# EAGLE schematic BMS (EAGLE 9.6.2)
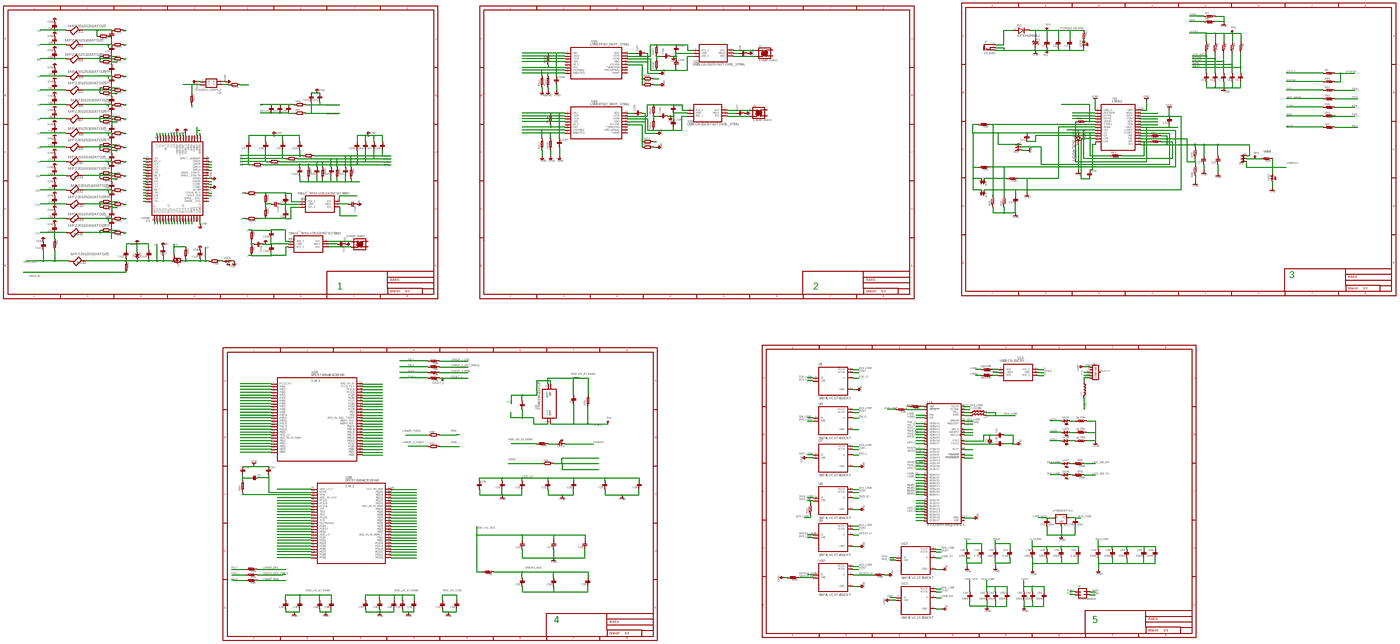
[diagram p0: schematic, sheet 1, overview]
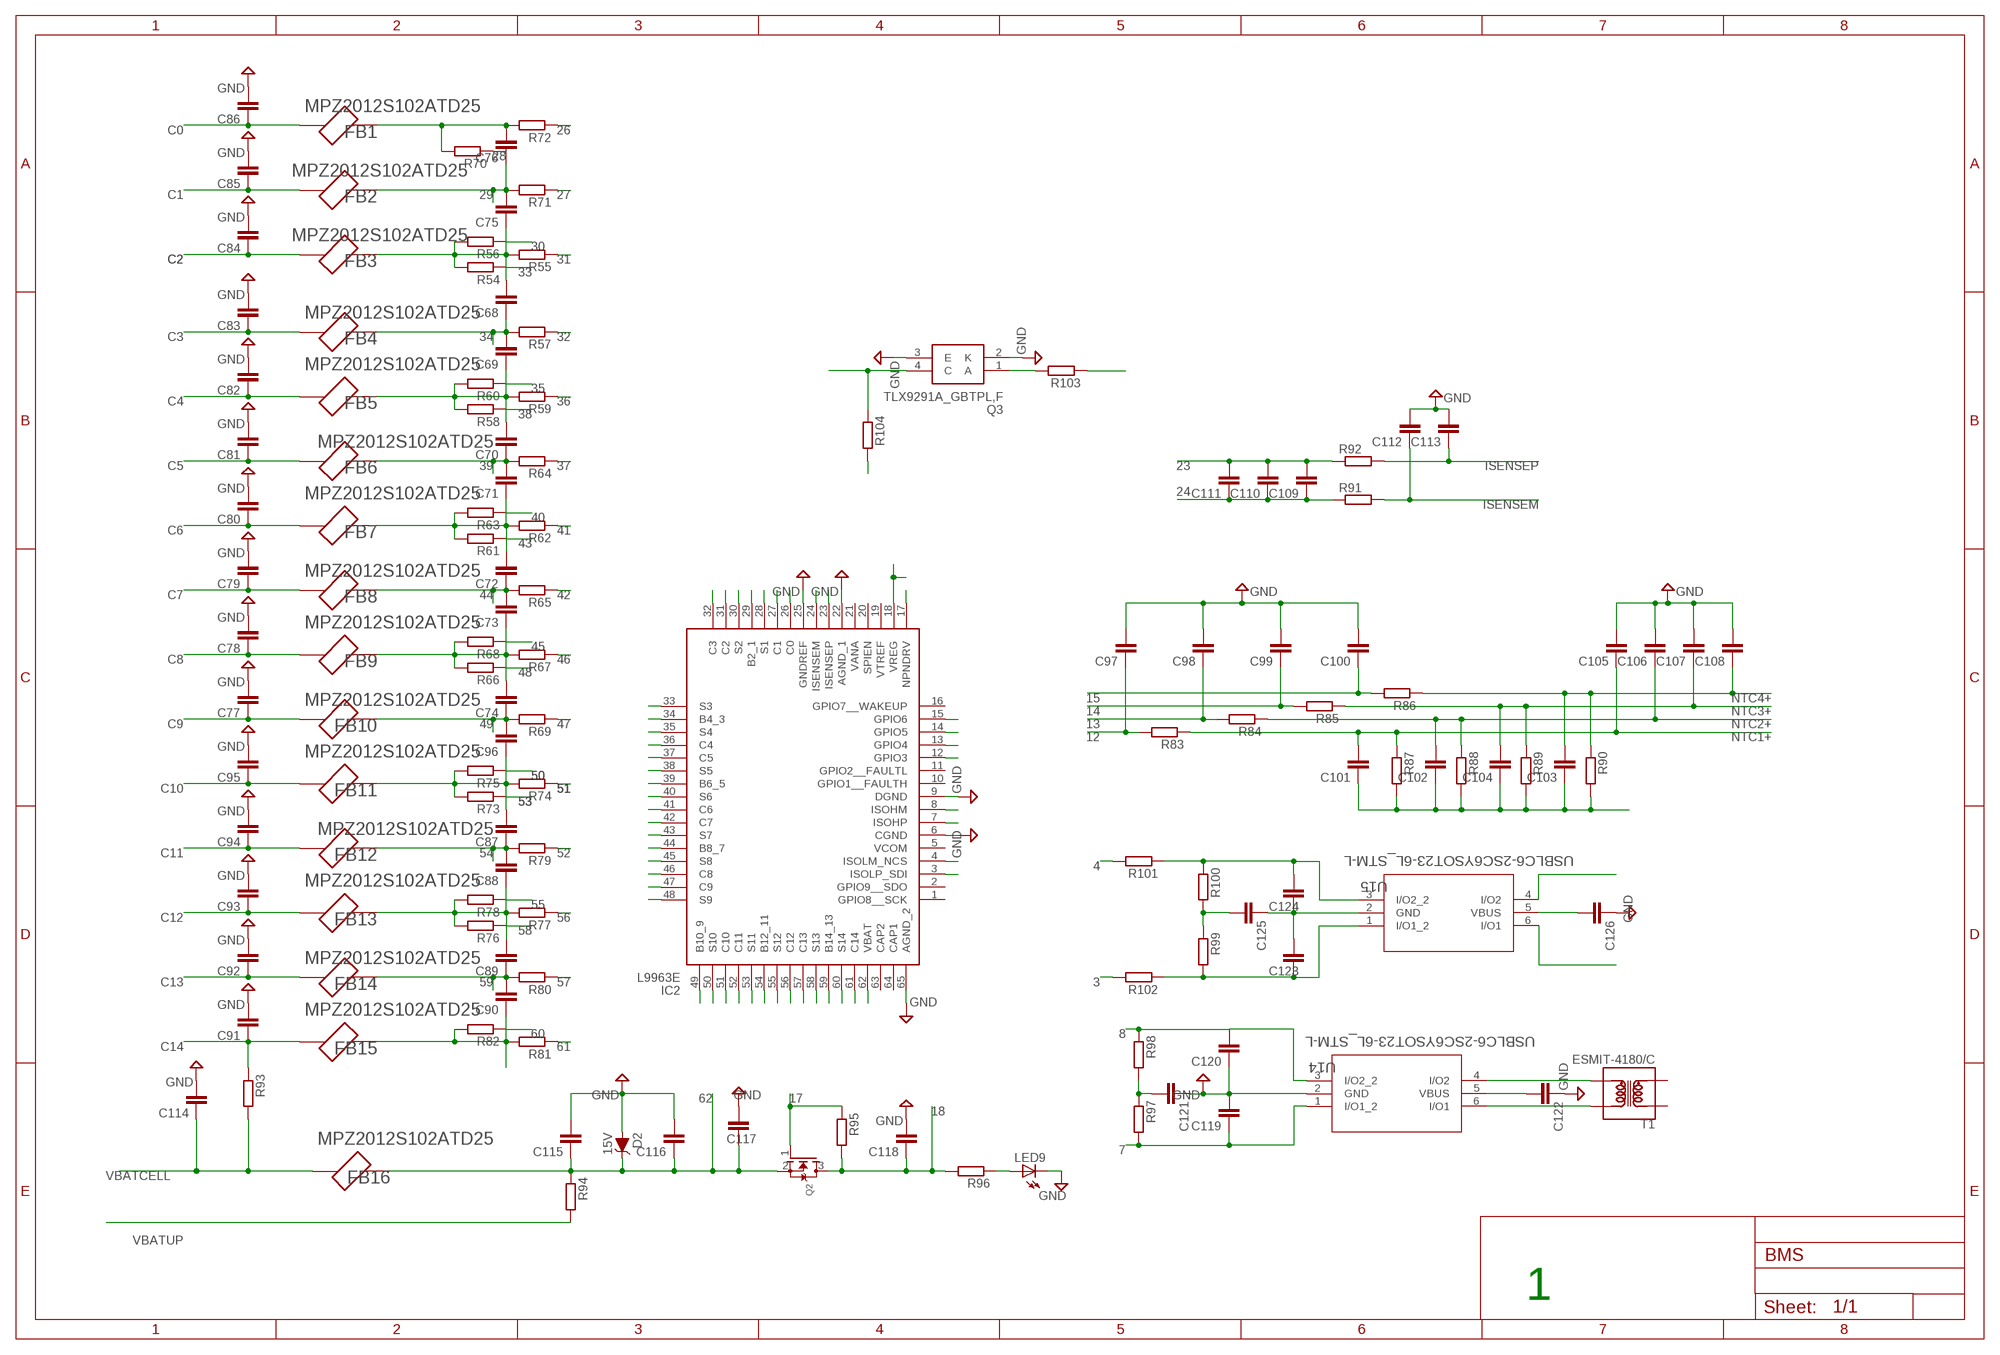
[diagram p1: schematic, sheet 1, part 1 of 7]
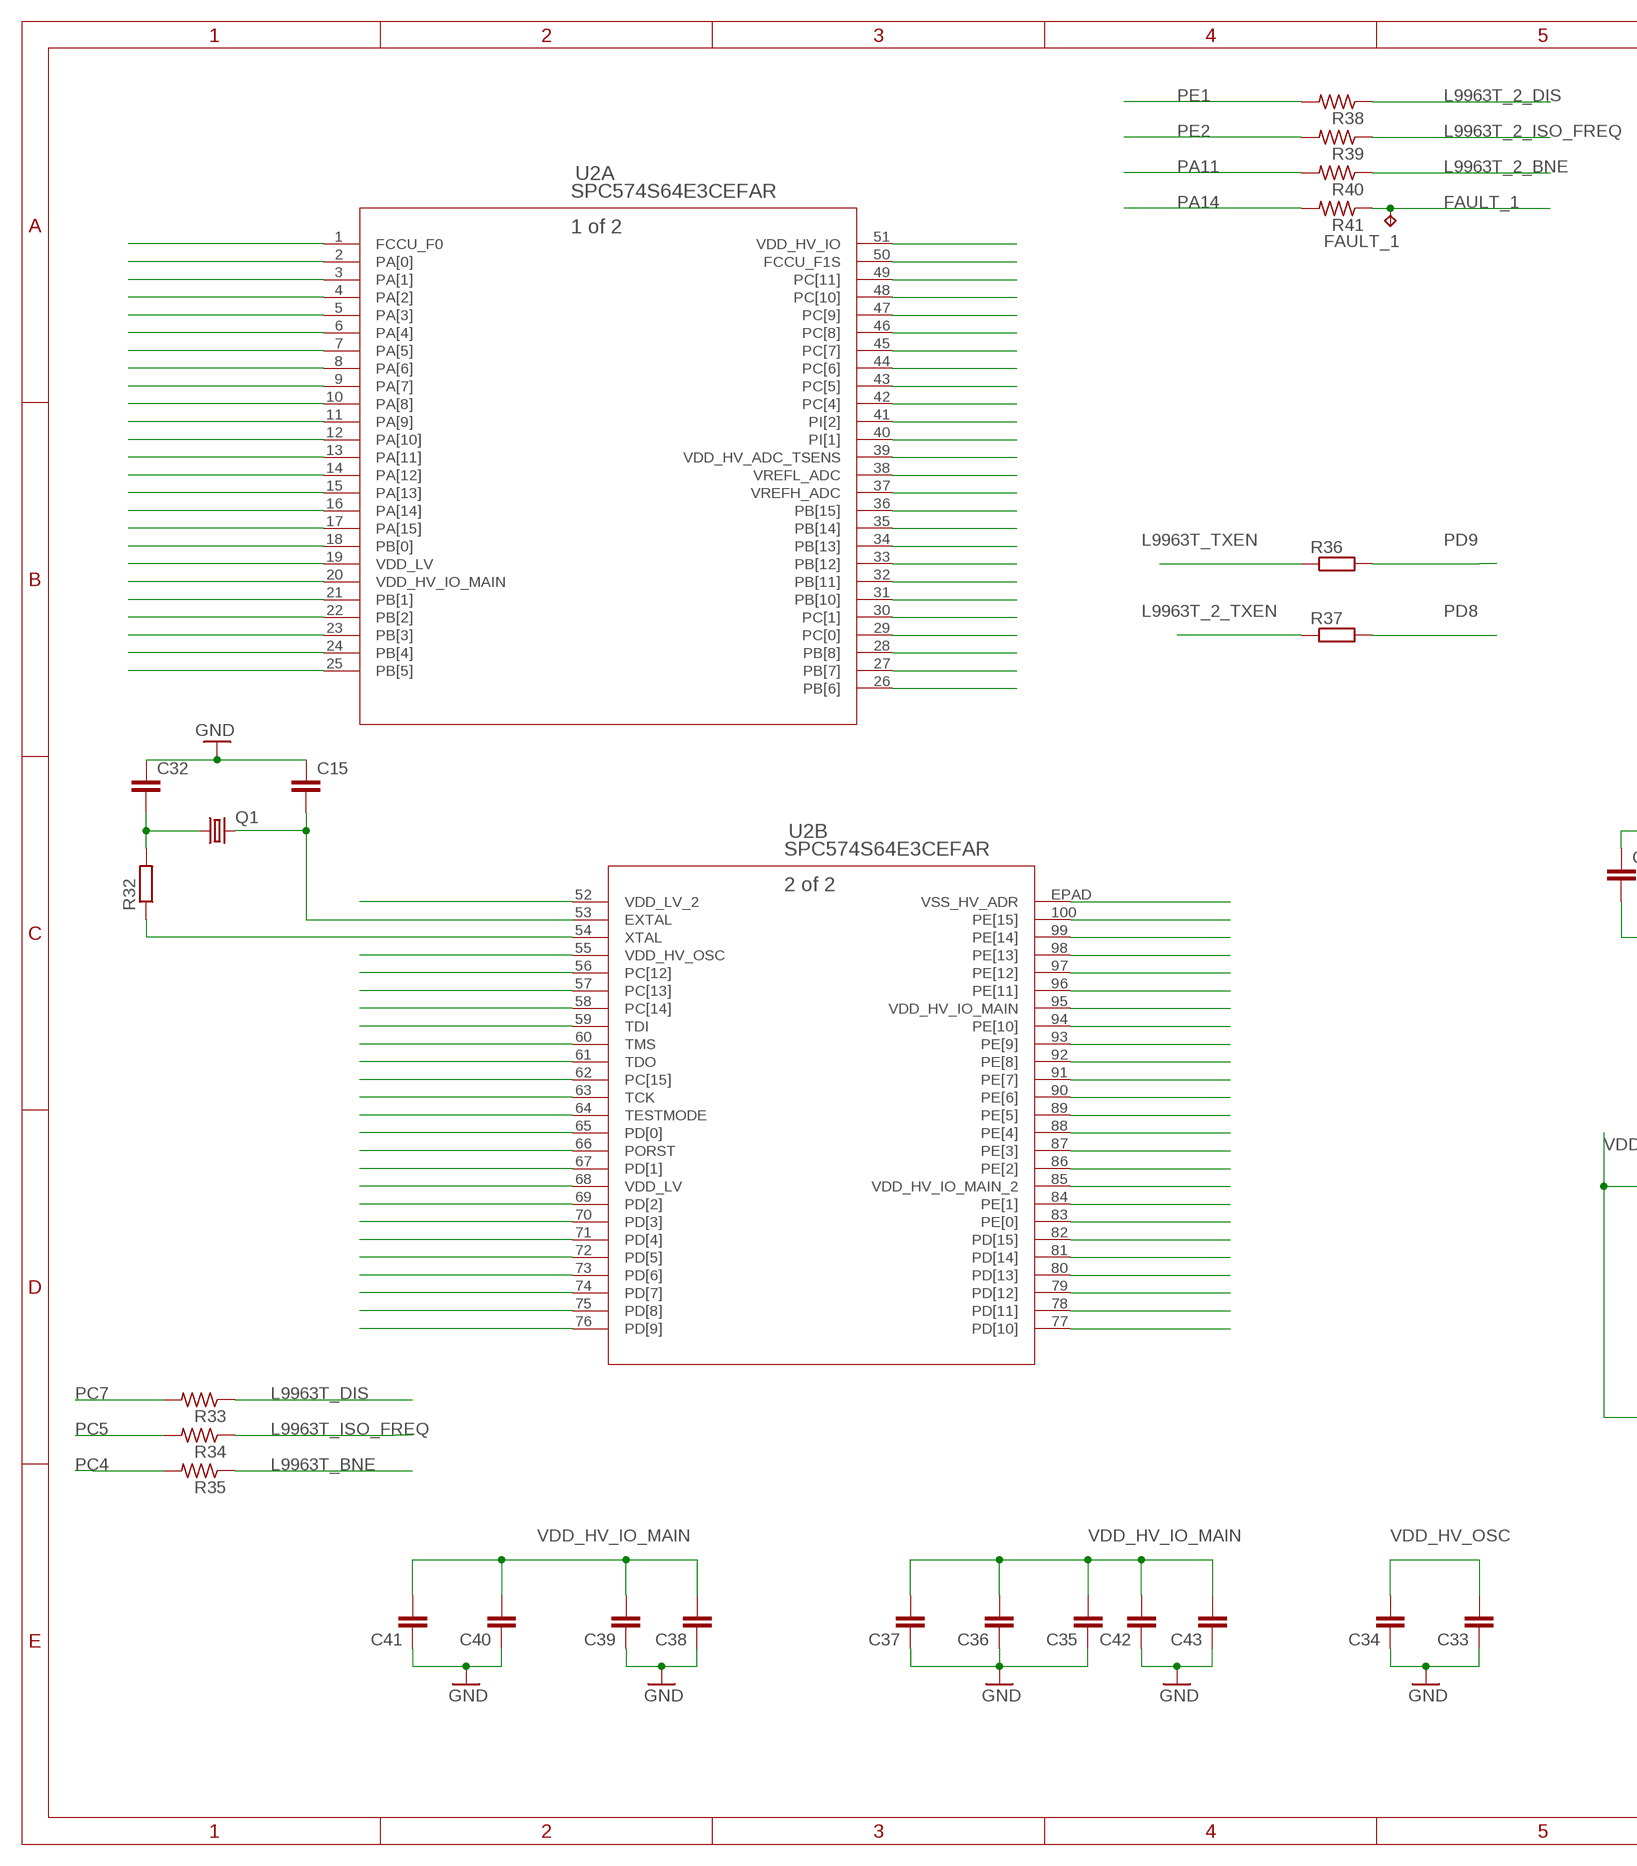
[diagram p2: schematic, sheet 1, part 2 of 7]
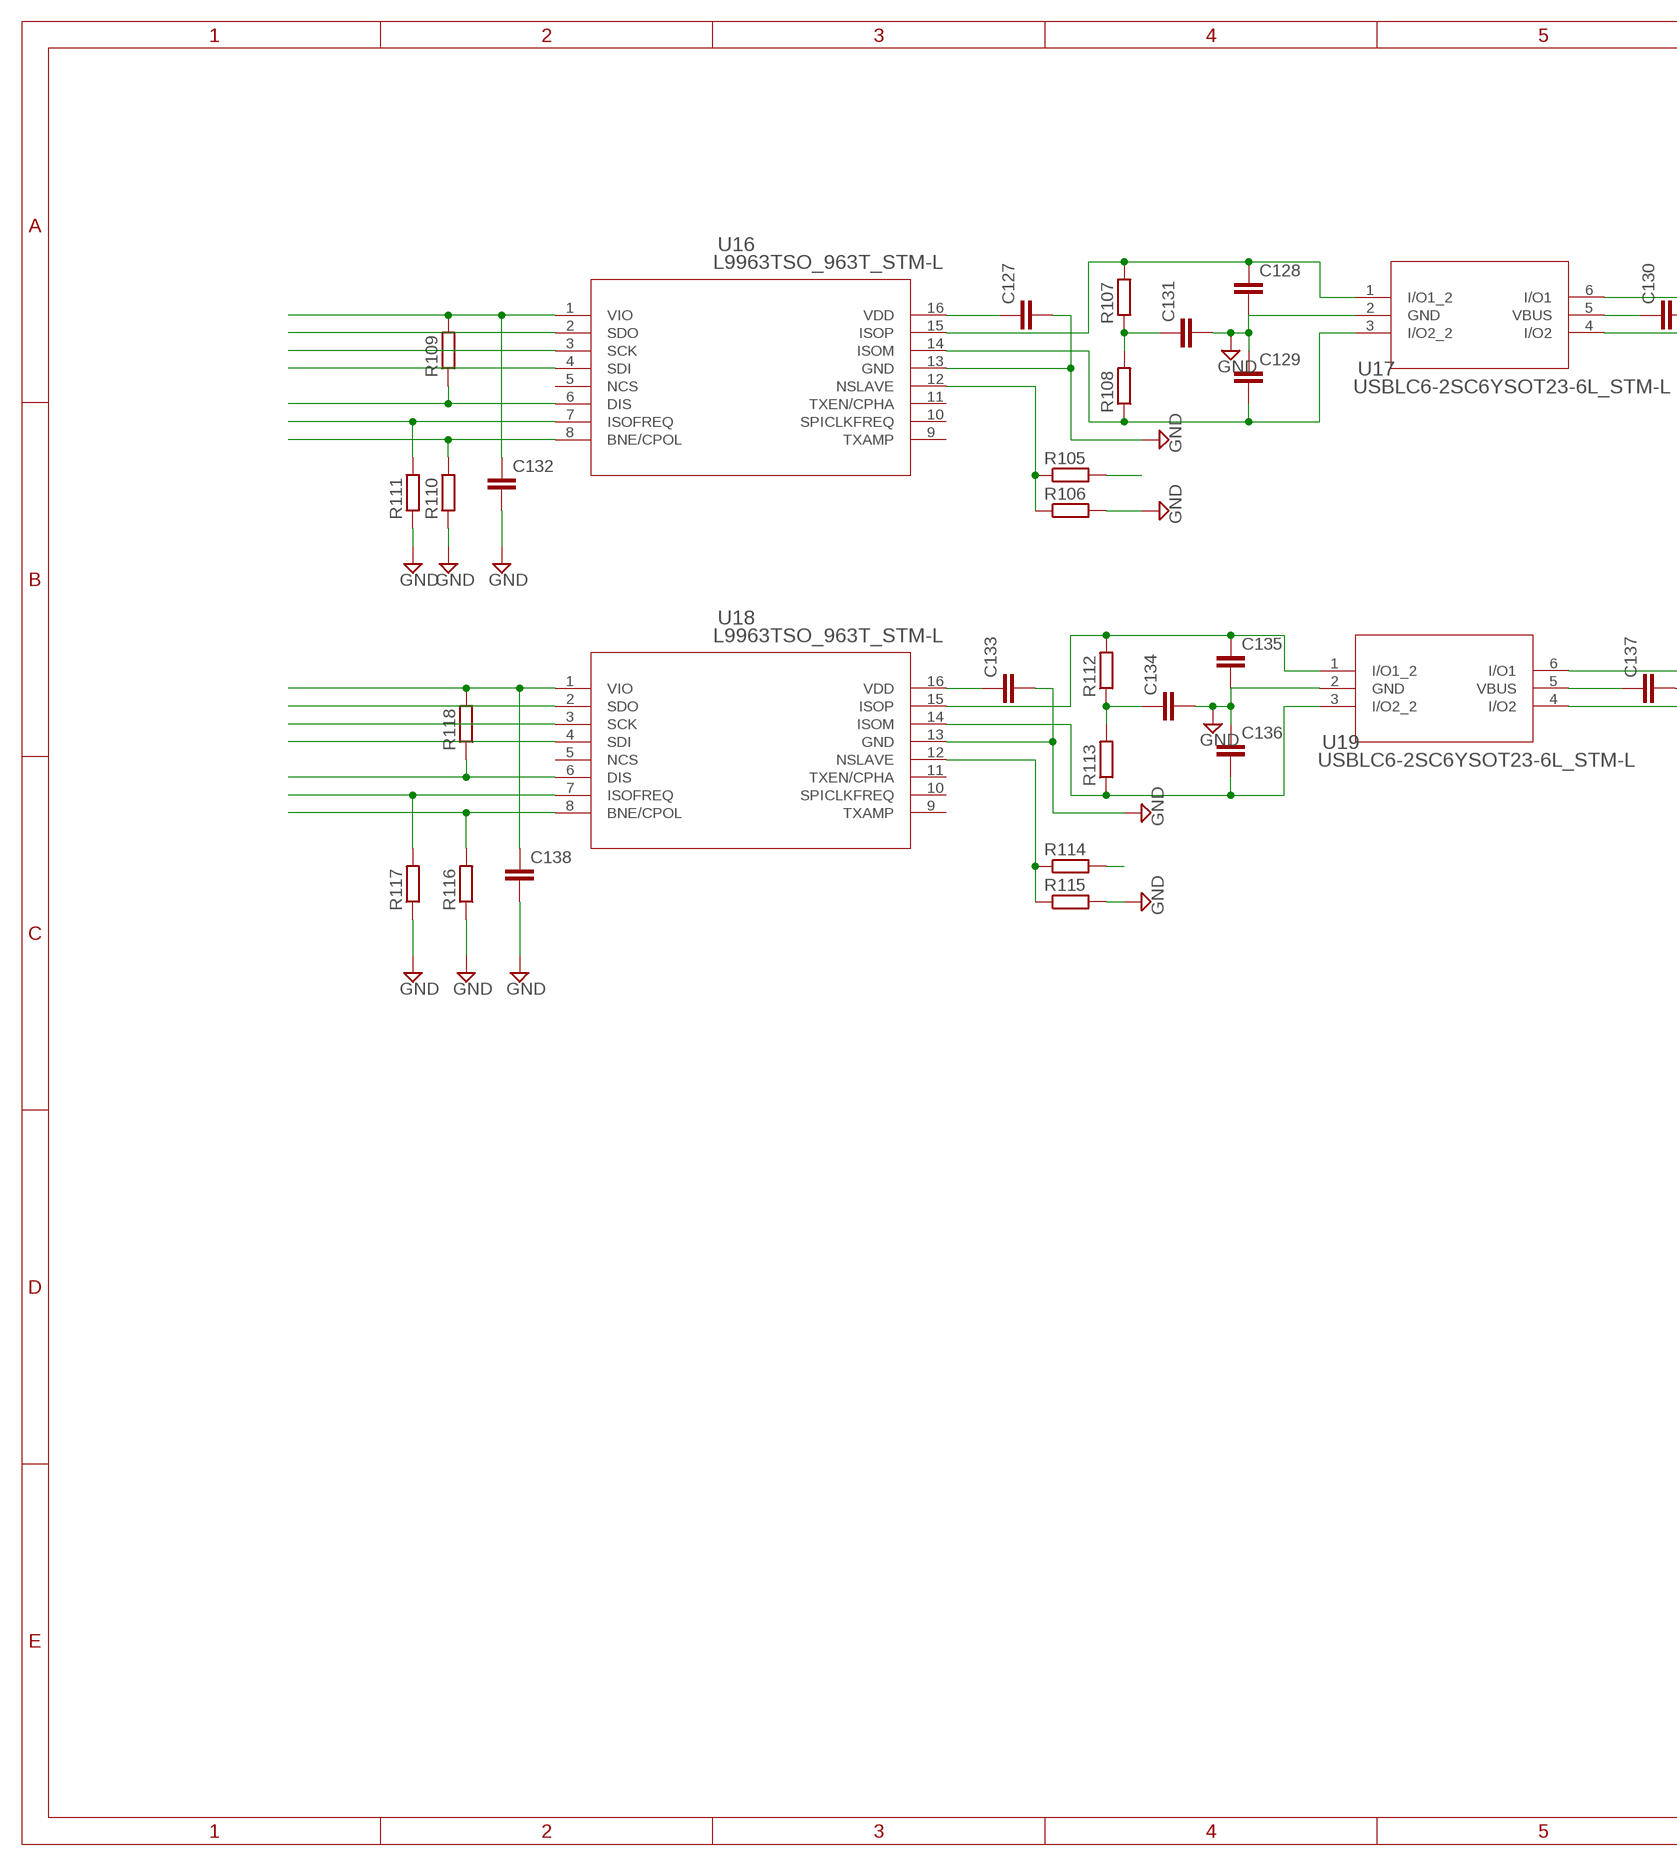
[diagram p3: schematic, sheet 1, part 3 of 7]
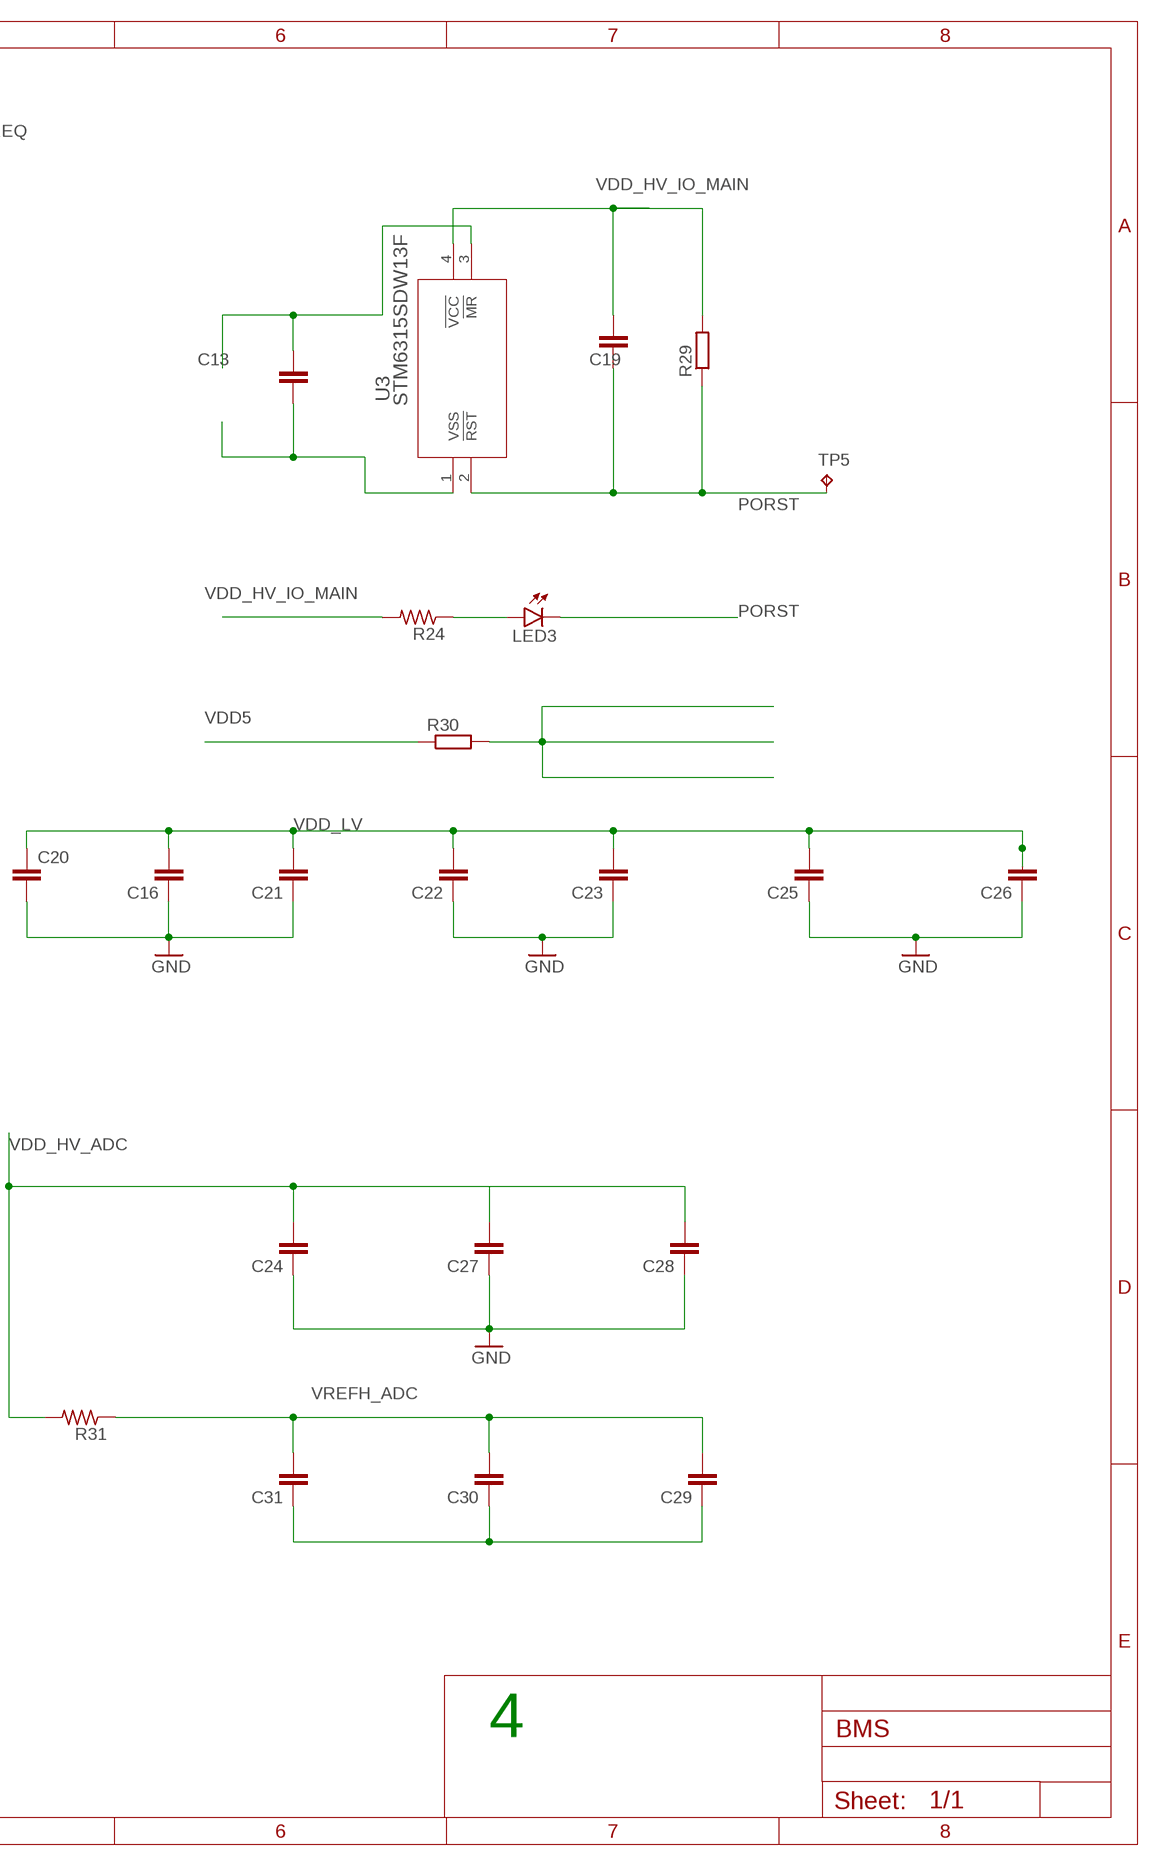
[diagram p4: schematic, sheet 1, part 4 of 7]
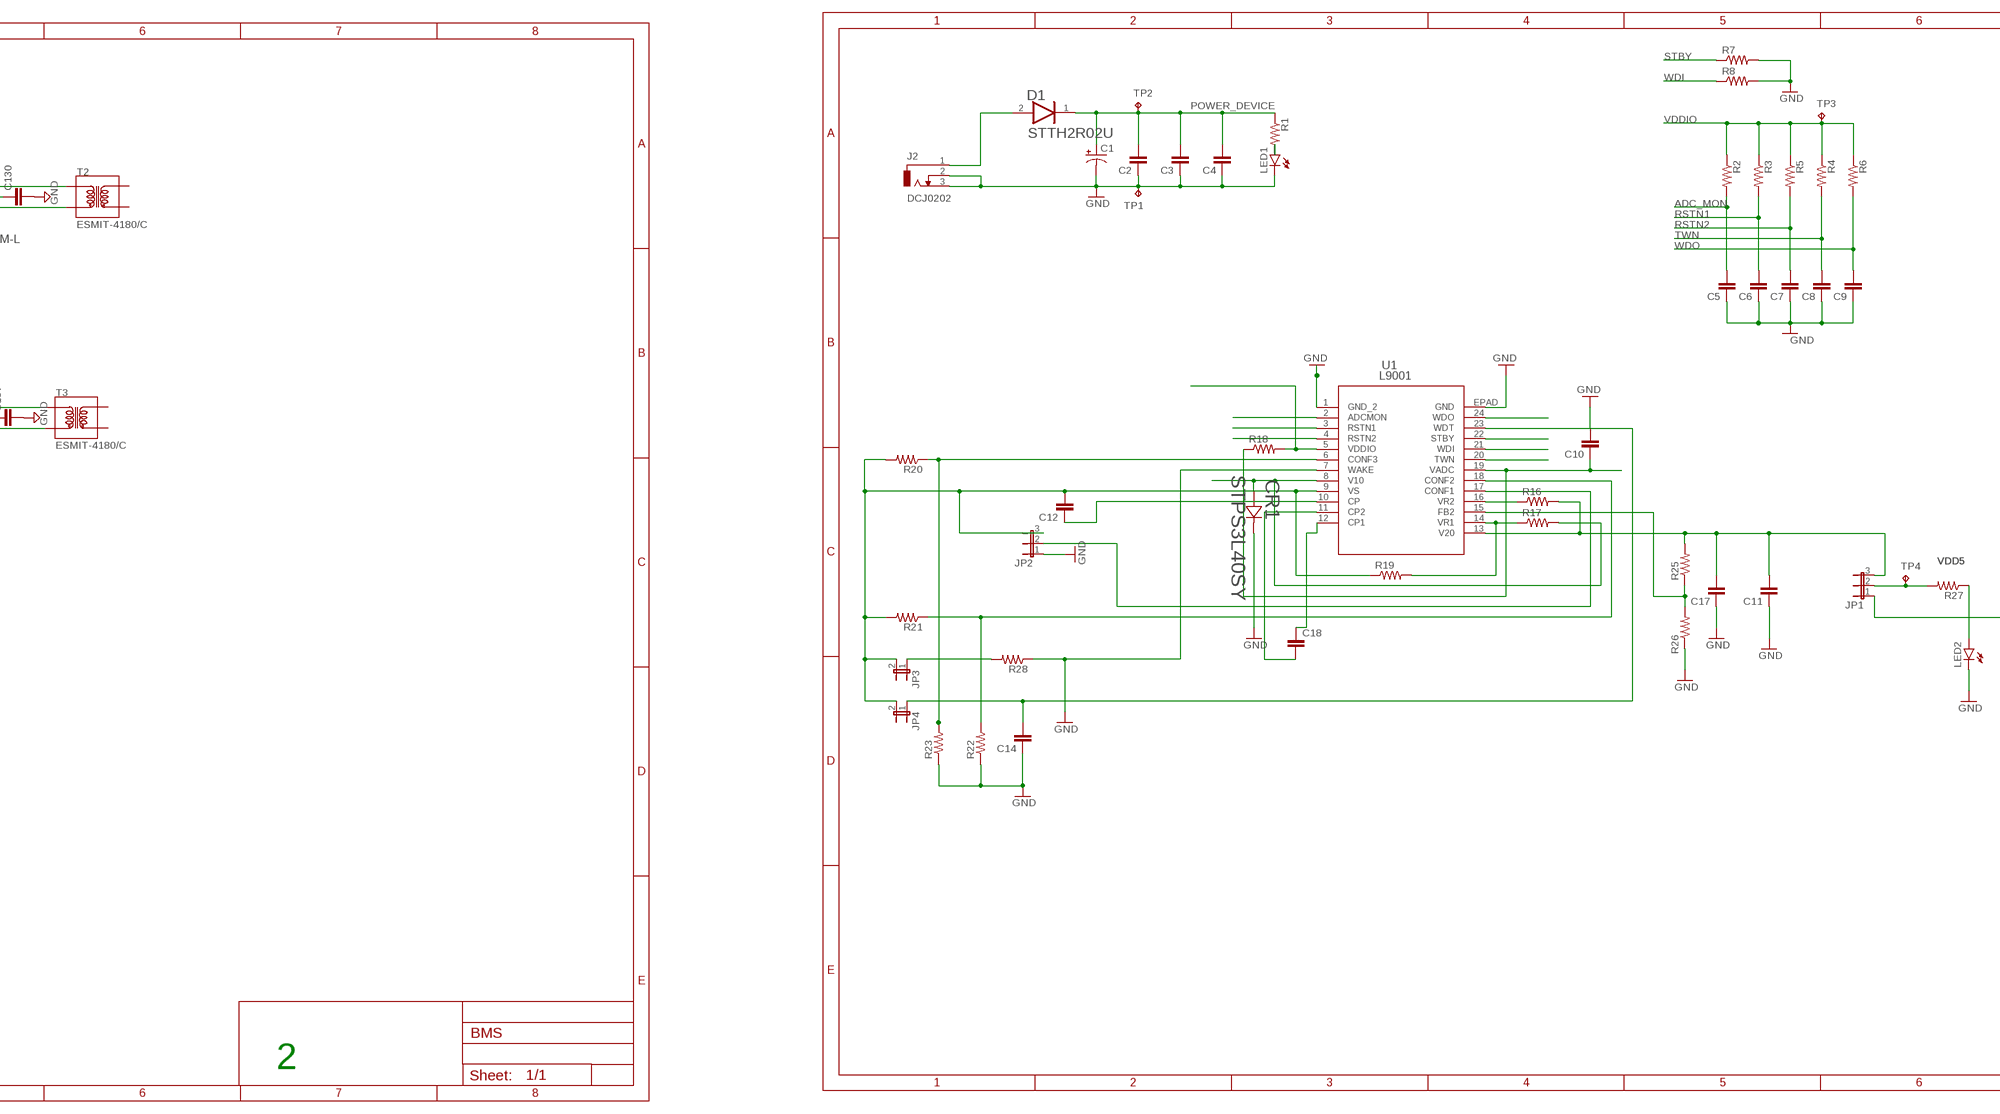
[diagram p5: schematic, sheet 1, part 5 of 7]
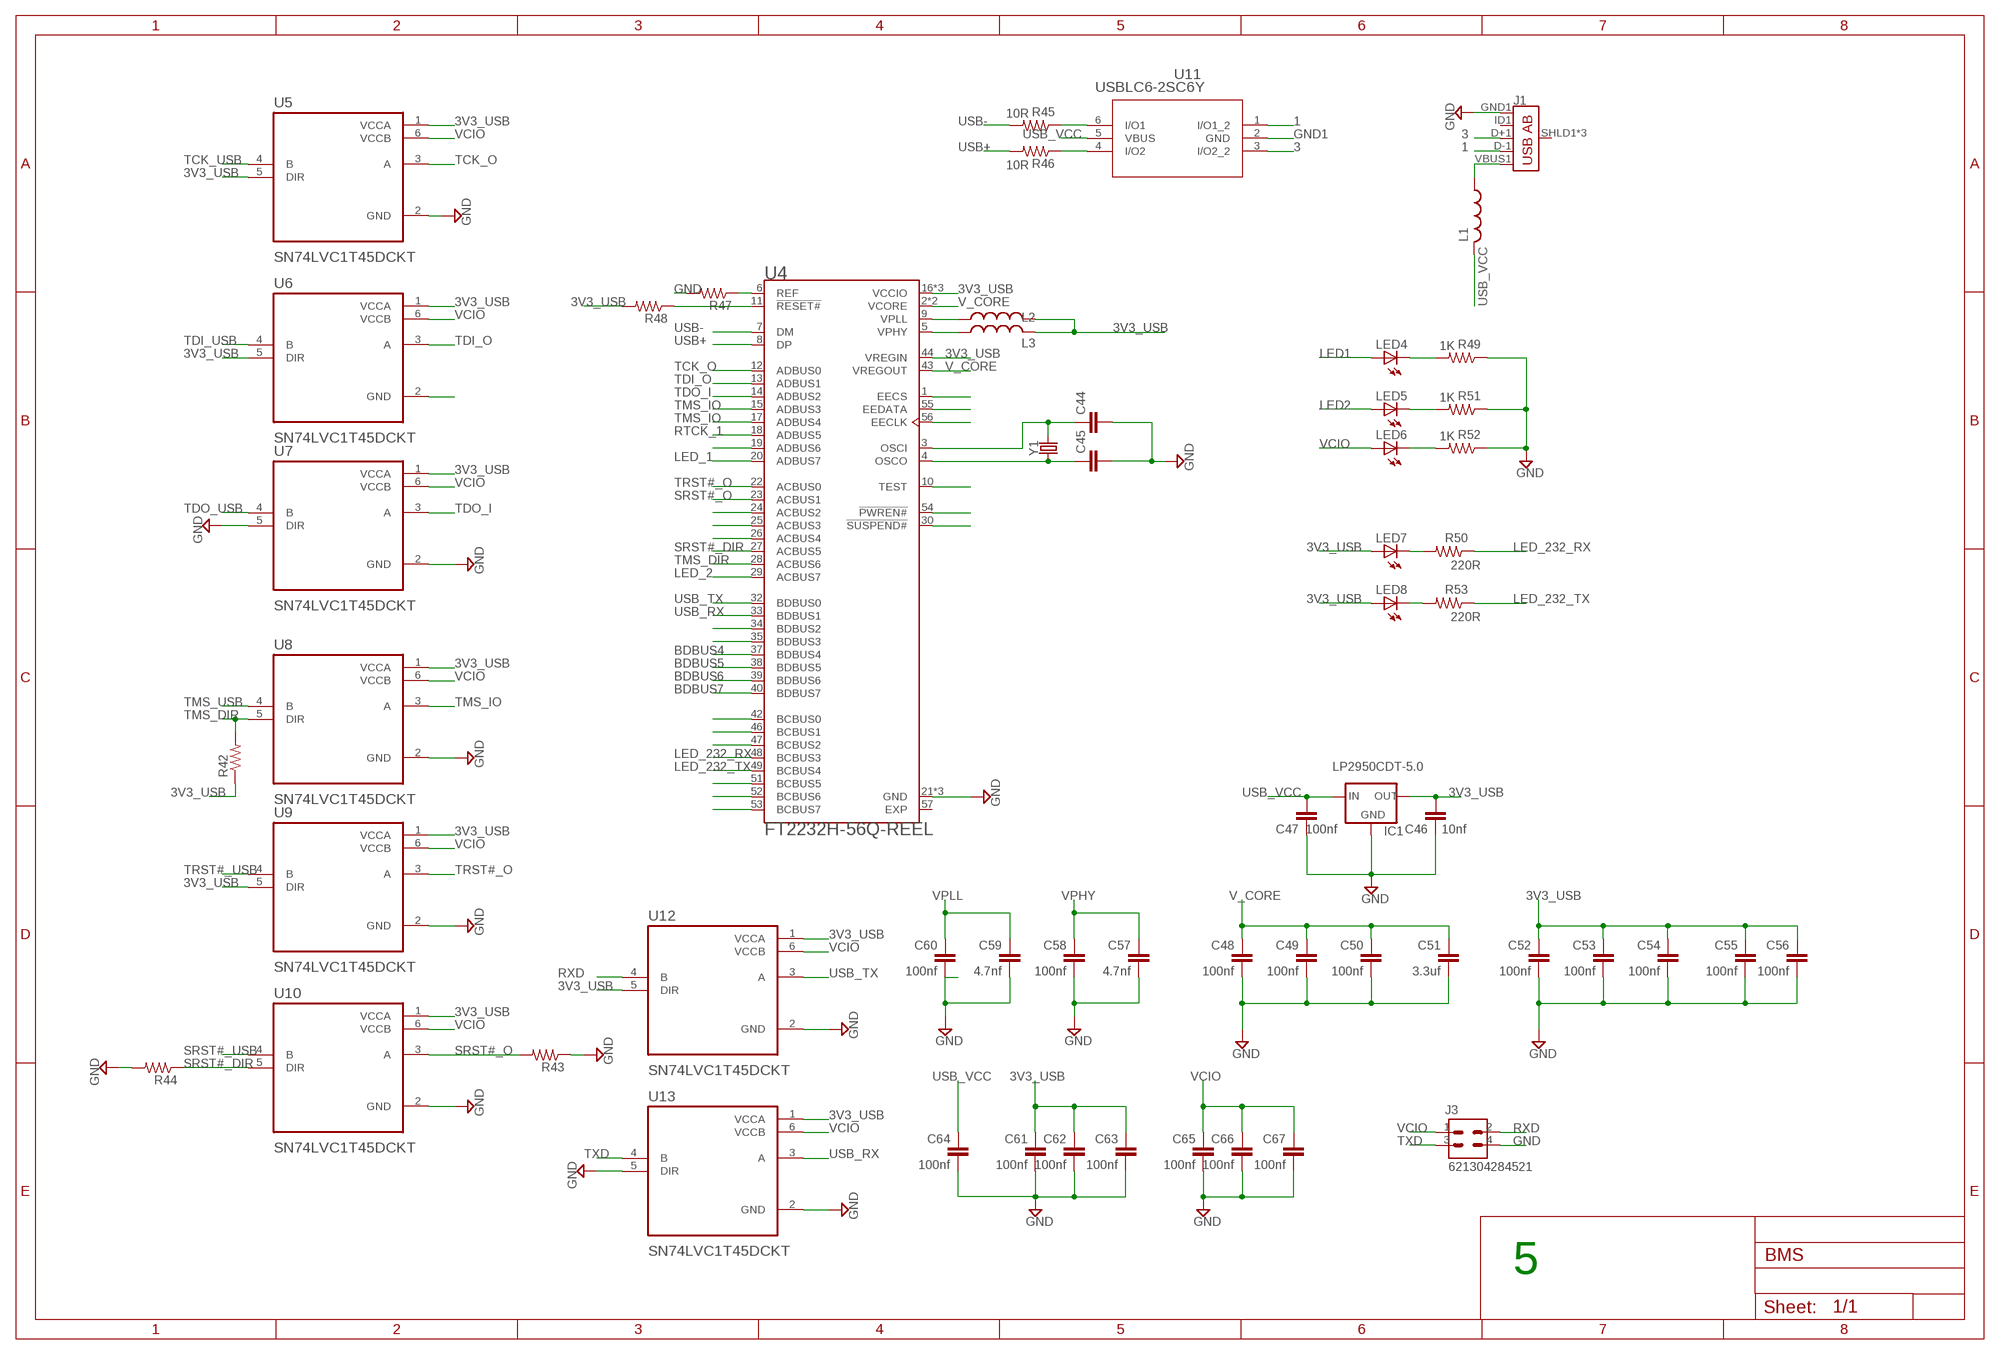
[diagram p6: schematic, sheet 1, part 6 of 7]
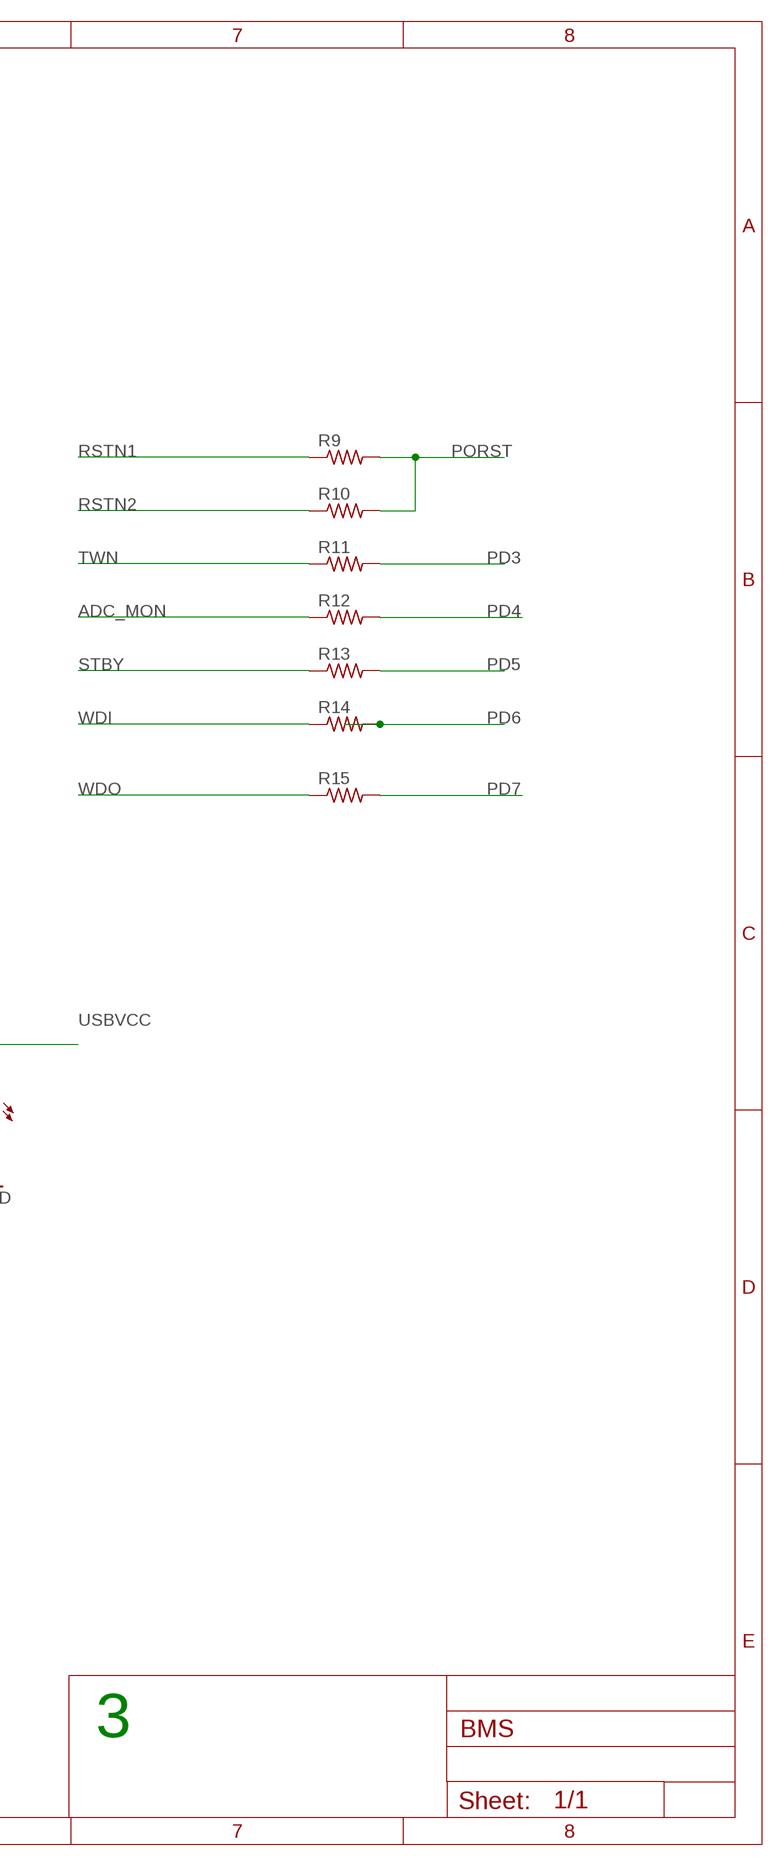
[diagram p7: schematic, sheet 1, part 7 of 7]

## Parts
C1  CPOL-US153CLV-0505  [153CLV-0505]
C2  C-EU025-025X050  [C025-025X050]
C3  C-EU025-025X050  [C025-025X050]
C4  C-EU025-025X050  [C025-025X050]
C5  C-EU025-025X050  [C025-025X050]
C6  C-EU025-025X050  [C025-025X050]
C7  C-EU025-025X050  [C025-025X050]
C8  C-EU025-025X050  [C025-025X050]
C9  C-EU025-025X050  [C025-025X050]
C10  C-EU025-025X050  [C025-025X050]
C11  C-EU025-025X050  [C025-025X050]
C12  C-EU025-025X050  [C025-025X050]
C13  C-EU025-025X050  [C025-025X050]
C14  C-EU025-025X050  [C025-025X050]
C15  C-EU025-025X050  [C025-025X050]
C16  C-EU025-025X050  [C025-025X050]
C17  C-EU025-025X050  [C025-025X050]
C18  C-EU025-025X050  [C025-025X050]
C19  C-EU025-025X050  [C025-025X050]
C20  C-EU025-025X050  [C025-025X050]
C21  C-EU025-025X050  [C025-025X050]
C22  C-EU025-025X050  [C025-025X050]
C23  C-EU025-025X050  [C025-025X050]
C24  C-EU025-025X050  [C025-025X050]
C25  C-EU025-025X050  [C025-025X050]
C26  C-EU025-025X050  [C025-025X050]
C27  C-EU025-025X050  [C025-025X050]
C28  C-EU025-025X050  [C025-025X050]
C29  C-EU025-025X050  [C025-025X050]
C30  C-EU025-025X050  [C025-025X050]
C31  C-EU025-025X050  [C025-025X050]
C32  C-EU025-025X050  [C025-025X050]
C33  C-EU025-025X050  [C025-025X050]
C34  C-EU025-025X050  [C025-025X050]
C35  C-EU025-025X050  [C025-025X050]
C36  C-EU025-025X050  [C025-025X050]
C37  C-EU025-025X050  [C025-025X050]
C38  C-EU025-025X050  [C025-025X050]
C39  C-EU025-025X050  [C025-025X050]
C40  C-EU025-025X050  [C025-025X050]
C41  C-EU025-025X050  [C025-025X050]
C42  C-EU025-025X050  [C025-025X050]
C43  C-EU025-025X050  [C025-025X050]
C44  C-EUC0603  [C0603]
C45  C-EUC0603  [C0603]
C46  10nf  C-EUC0603  [C0603]
C47  100nf  C-EUC0603  [C0603]
C48  100nf  C-EUC0603  [C0603]
C49  100nf  C-EUC0603  [C0603]
C50  100nf  C-EUC0603  [C0603]
C51  3.3uf  C-EUC0603  [C0603]
C52  100nf  C-EUC0603  [C0603]
C53  100nf  C-EUC0603  [C0603]
C54  100nf  C-EUC0603  [C0603]
C55  100nf  C-EUC0603  [C0603]
C56  100nf  C-EUC0603  [C0603]
C57  4.7nf  C-EUC0603  [C0603]
C58  100nf  C-EUC0603  [C0603]
C59  4.7nf  C-EUC0603  [C0603]
C60  100nf  C-EUC0603  [C0603]
C61  100nf  C-EUC0603  [C0603]
C62  100nf  C-EUC0603  [C0603]
C63  100nf  C-EUC0603  [C0603]
C64  100nf  C-EUC0603  [C0603]
C65  100nf  C-EUC0603  [C0603]
C66  100nf  C-EUC0603  [C0603]
C67  100nf  C-EUC0603  [C0603]
C68  C-EUC0402K  [C0402K]
C69  C-EUC0402K  [C0402K]
C70  C-EUC0402K  [C0402K]
C71  C-EUC0402K  [C0402K]
C72  C-EUC0402K  [C0402K]
C73  C-EUC0402K  [C0402K]
C74  C-EUC0402K  [C0402K]
C75  C-EUC0402K  [C0402K]
C76  C-EUC0402K  [C0402K]
C77  C-EUC0402K  [C0402K]
C78  C-EUC0402K  [C0402K]
C79  C-EUC0402K  [C0402K]
C80  C-EUC0402K  [C0402K]
C81  C-EUC0402K  [C0402K]
C82  C-EUC0402K  [C0402K]
C83  C-EUC0402K  [C0402K]
C84  C-EUC0402K  [C0402K]
C85  C-EUC0402K  [C0402K]
C86  C-EUC0402K  [C0402K]
C87  C-EUC0402K  [C0402K]
C88  C-EUC0402K  [C0402K]
C89  C-EUC0402K  [C0402K]
C90  C-EUC0402K  [C0402K]
C91  C-EUC0402K  [C0402K]
C92  C-EUC0402K  [C0402K]
C93  C-EUC0402K  [C0402K]
C94  C-EUC0402K  [C0402K]
C95  C-EUC0402K  [C0402K]
C96  C-EUC0402K  [C0402K]
C97  C-EUC0402K  [C0402K]
C98  C-EUC0402K  [C0402K]
C99  C-EUC0402K  [C0402K]
C100  C-EUC0402K  [C0402K]
C101  C-EUC0402K  [C0402K]
C102  C-EUC0402K  [C0402K]
C103  C-EUC0402K  [C0402K]
C104  C-EUC0402K  [C0402K]
C105  C-EUC0402K  [C0402K]
C106  C-EUC0402K  [C0402K]
C107  C-EUC0402K  [C0402K]
C108  C-EUC0402K  [C0402K]
C109  C-EUC0402K  [C0402K]
C110  C-EUC0402K  [C0402K]
C111  C-EUC0402K  [C0402K]
C112  C-EUC0402K  [C0402K]
C113  C-EUC0402K  [C0402K]
C114  C-EUC0402K  [C0402K]
C115  C-EUC0402K  [C0402K]
C116  C-EUC0402K  [C0402K]
C117  C-EUC0402K  [C0402K]
C118  C-EUC0402K  [C0402K]
C119  C-EUC0402K  [C0402K]
C120  C-EUC0402K  [C0402K]
C121  C-EUC0402K  [C0402K]
C122  C-EUC0402K  [C0402K]
C123  C-EUC0402K  [C0402K]
C124  C-EUC0402K  [C0402K]
C125  C-EUC0402K  [C0402K]
C126  C-EUC0402K  [C0402K]
C127  C-EUC0402  [C0402]
C128  C-EUC0402  [C0402]
C129  C-EUC0402  [C0402]
C130  C-EUC0402  [C0402]
C131  C-EUC0402  [C0402]
C132  C-EUC0402  [C0402]
C133  C-EUC0402  [C0402]
C134  C-EUC0402  [C0402]
C135  C-EUC0402  [C0402]
C136  C-EUC0402  [C0402]
C137  C-EUC0402  [C0402]
C138  C-EUC0402  [C0402]
CR1  STPS3L40SY  [SMC_STM]
D1  STMICROELECTRONICS_STTH2R02USTMICROELECTRONICS_STTH2R02U_0_0  [STMICROELECTRONICS_STTH2R02U_0]
D2  15V  DIODE-ZENER-DZ2J150M0L  [PANASONIC_SMINI2-F5-B]
FAULT_1  TPB1,27  [B1,27]
FB1  MPZ2012S102ATD25  [BEADC2012X105N]
FB2  MPZ2012S102ATD25  [BEADC2012X105N]
FB3  MPZ2012S102ATD25  [BEADC2012X105N]
FB4  MPZ2012S102ATD25  [BEADC2012X105N]
FB5  MPZ2012S102ATD25  [BEADC2012X105N]
FB6  MPZ2012S102ATD25  [BEADC2012X105N]
FB7  MPZ2012S102ATD25  [BEADC2012X105N]
FB8  MPZ2012S102ATD25  [BEADC2012X105N]
FB9  MPZ2012S102ATD25  [BEADC2012X105N]
FB10  MPZ2012S102ATD25  [BEADC2012X105N]
FB11  MPZ2012S102ATD25  [BEADC2012X105N]
FB12  MPZ2012S102ATD25  [BEADC2012X105N]
FB13  MPZ2012S102ATD25  [BEADC2012X105N]
FB14  MPZ2012S102ATD25  [BEADC2012X105N]
FB15  MPZ2012S102ATD25  [BEADC2012X105N]
FB16  MPZ2012S102ATD25  [BEADC2012X105N]
IC1  LP2950CDT-5.0  [DPACK]
IC2  L9963E  [QFP50P1200X1200X120-65N]
J1  USB_AB_SMT  [USB-AB-MICRO-SMD]
J2  DCJ0202  [DCJ0202]
J3  621304284521  [621304284521]
JP1  JP2E  [JP2]
JP2  JP2E  [JP2]
JP3  JP1E  [JP1]
JP4  JP1E  [JP1]
L1  L-USL2012C  [L2012C]
L2  L-USL2012C  [L2012C]
L3  L-USL2012C  [L2012C]
LED1  LAP4-BOTTOM  [P47F-BOTTOM]
LED2  LAP4-BOTTOM  [P47F-BOTTOM]
LED3  LAP4-BOTTOM  [P47F-BOTTOM]
LED4  LED  [SMARTLED-TTW]
LED5  LED  [SMARTLED-TTW]
LED6  LED  [SMARTLED-TTW]
LED7  LED  [SMARTLED-TTW]
LED8  LED  [SMARTLED-TTW]
LED9  LED  [SMARTLED-TTW]
Q1  CRYSTALHC49U-V  [HC49U-V]
Q2  MOSFET-NREFLOW  [SOT23]
Q3  TLX9291A_GBTPL,F  [SOIC127P700X230-4N]
R1  R-US_R0603  [R0603]
R2  R-US_R0603  [R0603]
R3  R-US_R0603  [R0603]
R4  R-US_R0603  [R0603]
R5  R-US_R0603  [R0603]
R6  R-US_R0603  [R0603]
R7  R-US_R0603  [R0603]
R8  R-US_R0603  [R0603]
R9  R-US_R0603  [R0603]
R10  R-US_R0603  [R0603]
R11  R-US_R0603  [R0603]
R12  R-US_R0603  [R0603]
R13  R-US_R0603  [R0603]
R14  R-US_R0603  [R0603]
R15  R-US_R0603  [R0603]
R16  R-US_R0805  [R0805]
R17  R-US_R0805  [R0805]
R18  R-US_R0805  [R0805]
R19  R-US_R0805  [R0805]
R20  R-US_R0805  [R0805]
R21  R-US_R0805  [R0805]
R22  R-US_R0805  [R0805]
R23  R-US_R0805  [R0805]
R24  R-US_R0805  [R0805]
R25  R-US_R0805  [R0805]
R26  R-US_R0805  [R0805]
R27  R-US_R0805  [R0805]
R28  R-US_R0805  [R0805]
R29  R-EU_0207/10  [0207/10]
R30  R-EU_0207/10  [0207/10]
R31  R-US_R0805  [R0805]
R32  R-EU_0207/10  [0207/10]
R33  R-US_R0805  [R0805]
R34  R-US_R0805  [R0805]
R35  R-US_R0805  [R0805]
R36  R-EU_0207/10  [0207/10]
R37  R-EU_0207/10  [0207/10]
R38  R-US_R0805  [R0805]
R39  R-US_R0805  [R0805]
R40  R-US_R0805  [R0805]
R41  R-US_R0805  [R0805]
R42  R-US_M0805  [M0805]
R43  R-US_M0805  [M0805]
R44  R-US_M0805  [M0805]
R45  10R  R-US_M0805  [M0805]
R46  10R  R-US_M0805  [M0805]
R47  12K  R-US_M0805  [M0805]
R48  1K  R-US_M0805  [M0805]
R49  1K  R-US_M0805  [M0805]
R50  220R  R-US_M0805  [M0805]
R51  1K  R-US_M0805  [M0805]
R52  1K  R-US_M0805  [M0805]
R53  220R  R-US_M0805  [M0805]
R54  R-EU_R0603  [R0603]
R55  R-EU_R0603  [R0603]
R56  R-EU_R0603  [R0603]
R57  R-EU_R0603  [R0603]
R58  R-EU_R0603  [R0603]
R59  R-EU_R0603  [R0603]
R60  R-EU_R0603  [R0603]
R61  R-EU_R0603  [R0603]
R62  R-EU_R0603  [R0603]
R63  R-EU_R0603  [R0603]
R64  R-EU_R0603  [R0603]
R65  R-EU_R0603  [R0603]
R66  R-EU_R0603  [R0603]
R67  R-EU_R0603  [R0603]
R68  R-EU_R0603  [R0603]
R69  R-EU_R0603  [R0603]
R70  R-EU_R0603  [R0603]
R71  R-EU_R0603  [R0603]
R72  R-EU_R0603  [R0603]
R73  R-EU_R0603  [R0603]
R74  R-EU_R0603  [R0603]
R75  R-EU_R0603  [R0603]
R76  R-EU_R0603  [R0603]
R77  R-EU_R0603  [R0603]
R78  R-EU_R0603  [R0603]
R79  R-EU_R0603  [R0603]
R80  R-EU_R0603  [R0603]
R81  R-EU_R0603  [R0603]
R82  R-EU_R0603  [R0603]
R83  R-EU_R0603  [R0603]
R84  R-EU_R0603  [R0603]
R85  R-EU_R0603  [R0603]
R86  R-EU_R0603  [R0603]
R87  R-EU_R0603  [R0603]
R88  R-EU_R0603  [R0603]
R89  R-EU_R0603  [R0603]
R90  R-EU_R0603  [R0603]
R91  R-EU_R0603  [R0603]
R92  R-EU_R0603  [R0603]
R93  R-EU_R0603  [R0603]
R94  R-EU_R0603  [R0603]
R95  R-EU_R0603  [R0603]
R96  R-EU_R0603  [R0603]
R97  R-EU_R0603  [R0603]
R98  R-EU_R0603  [R0603]
R99  R-EU_R0603  [R0603]
R100  R-EU_R0603  [R0603]
R101  R-EU_R0603  [R0603]
R102  R-EU_R0603  [R0603]
R103  R-EU_M0805  [M0805]
R104  R-EU_M0805  [M0805]
R105  R-EU_M0805  [M0805]
R106  R-EU_M0805  [M0805]
R107  R-EU_M0805  [M0805]
R108  R-EU_M0805  [M0805]
R109  R-EU_M0805  [M0805]
R110  R-EU_M0805  [M0805]
R111  R-EU_M0805  [M0805]
R112  R-EU_M0805  [M0805]
R113  R-EU_M0805  [M0805]
R114  R-EU_M0805  [M0805]
R115  R-EU_M0805  [M0805]
R116  R-EU_M0805  [M0805]
R117  R-EU_M0805  [M0805]
R118  R-EU_M0805  [M0805]
T1  ESMIT-4180/C  [XFMR_ESMIT-4180/C]
T2  ESMIT-4180/C  [XFMR_ESMIT-4180/C]
T3  ESMIT-4180/C  [XFMR_ESMIT-4180/C]
TP1  TPB1,27  [B1,27]
TP2  TPB1,27  [B1,27]
TP3  TPB1,27  [B1,27]
TP4  TPB1,27  [B1,27]
TP5  TPB1,27  [B1,27]
U1  L9001  [POWERSSO-24_OPTA_STM]
U2  SPC574S64E3CEFAR  [ETQFP100_STM]
U3  STM6315SDW13F  [SOT143-4_STM]
U4  FT2232H-56Q-REEL  [QFN50P800X800X100-57N]
U5  SN74LVC1T45DCKT  [SOT65P210X110-6N]
U6  SN74LVC1T45DCKT  [SOT65P210X110-6N]
U7  SN74LVC1T45DCKT  [SOT65P210X110-6N]
U8  SN74LVC1T45DCKT  [SOT65P210X110-6N]
U9  SN74LVC1T45DCKT  [SOT65P210X110-6N]
U10  SN74LVC1T45DCKT  [SOT65P210X110-6N]
U11  USBLC6-2SC6Y  [SOT23-6L_STM]
U12  SN74LVC1T45DCKT  [SOT65P210X110-6N]
U13  SN74LVC1T45DCKT  [SOT65P210X110-6N]
U14  USBLC6-2SC6YSOT23-6L_STM-L  [SOT23-6L_STM-L]
U15  USBLC6-2SC6YSOT23-6L_STM-L  [SOT23-6L_STM-L]
U16  L9963TSO_963T_STM-L  [SO_963T_STM-L]
U17  USBLC6-2SC6YSOT23-6L_STM-L  [SOT23-6L_STM-L]
U18  L9963TSO_963T_STM-L  [SO_963T_STM-L]
U19  USBLC6-2SC6YSOT23-6L_STM-L  [SOT23-6L_STM-L]
Y1  CRYSTAL-12MHZ  [CRYSTAL-SMD-2X2.5MM]

## Nets
1: J1.D-1(D-) U11.1(I/O1_2)
3: IC2.3(ISOLP_SDI) J1.D+1(D+) R102.2 U11.3(I/O2_2)
3V3_USB: C46.2 C52.2 C53.2 C54.2 C55.2 C56.2 C61.2 C62.2 C63.2 IC1.3(OUT) L2.2 L3.2 LED7.A@1(A) LED8.A@1(A) R42.1 R48.2 U4.16(VCCIO) U4.36(VCCIO) U4.44(VREGIN) U4.50(VCCIO) U5.1(VCCA) U5.5(DIR) U6.1(VCCA) U6.5(DIR) U7.1(VCCA) U8.1(VCCA) U9.1(VCCA) U9.5(DIR) U10.1(VCCA) U12.1(VCCA) U12.5(DIR) U13.1(VCCA)
4: IC2.4(ISOLM_NCS) R101.2
7: C119.1 IC2.7(ISOHP) R97.2 U14.1(I/O1_2)
8: C120.2 IC2.8(ISOHM) R98.1 U14.3(I/O2_2)
12: C97.1 IC2.12(GPIO3) R83.2
13: C98.1 IC2.13(GPIO4) R84.2
14: C99.1 IC2.14(GPIO5) R85.2
15: C100.1 IC2.15(GPIO6) R86.2
17: IC2.17(NPNDRV) Q2.1(G) R95.1
18: C118.1 Q2.3(D) R95.2 R96.2
23: C109.2 C110.2 C111.2 IC2.23(ISENSEP) R92.1
24: C109.1 C110.1 C111.1 IC2.24(ISENSEM) R91.1
26: IC2.26(C0) R72.1
27: IC2.27(C1) R71.1
28: IC2.28(S1) R70.1
29: C75.2 C76.1 FB2.1 IC2.29(B2_1) R71.2
30: IC2.30(S2) R56.1
31: IC2.31(C2) R55.1
32: IC2.32(C3) R57.1
33: IC2.33(S3) R54.1
34: C68.1 C69.2 C76.2 FB1.1 FB4.1 IC2.34(B4_3) R57.2 R70.2 R72.2
35: IC2.35(S4) R60.1
36: IC2.36(C4) R59.1
37: IC2.37(C5) R64.1
38: IC2.38(S5) R58.1
39: C70.1 C71.2 FB6.1 IC2.39(B6_5) R64.2
40: IC2.40(S6) R63.1
41: IC2.41(C6) R62.1
42: IC2.42(C7) R65.1
43: IC2.43(S7) R61.1
44: C72.1 C73.2 FB8.1 IC2.44(B8_7) R65.2
45: IC2.45(S8) R68.1
46: IC2.46(C8) R67.1
47: IC2.47(C9) R69.1
48: IC2.48(S9) R66.1
49: C74.1 C96.2 FB10.1 IC2.49(B10_9) R69.2
50: IC2.50(S10) R75.1
51: IC2.51(C10) R74.1
52: IC2.52(C11) R79.1
53: IC2.53(S11) R73.1
54: C87.1 C88.2 FB12.1 IC2.54(B12_11) R79.2
55: IC2.55(S12) R78.1
56: IC2.56(C12) R77.1
57: IC2.57(C13) R80.1
58: IC2.58(S13) R76.1
59: C89.1 C90.2 FB14.1 IC2.59(B14_13) R80.2
60: IC2.60(S14) R82.1
61: IC2.61(C14) R81.1
62: C115.1 C116.1 C117.1 D2.C FB16.1 IC2.62(VBAT) Q2.2(S) R94.1
ADC_MON: C5.2 R2.2 R12.1
BDBUS4: U4.37(BDBUS4)
BDBUS5: U4.38(BDBUS5)
BDBUS6: U4.39(BDBUS6)
BDBUS7: U4.40(BDBUS7)
C0: C86.1 FB1.2
C1: C85.1 FB2.2
C2: C84.1 FB3.2
C3: C83.1 FB4.2
C4: C82.1 FB5.2
C5: C81.1 FB6.2
C6: C80.1 FB7.2
C7: C79.1 FB8.2
C8: C78.1 FB9.2
C9: C77.1 FB10.2
C10: C95.1 FB11.2
C11: C94.1 FB12.2
C12: C93.1 FB13.2
C13: C92.1 FB14.2
C14: C91.1 FB15.2 R93.1
EECLK: U4.56(EECLK)
EECS: U4.1(EECS)
EEDATA: U4.55(EEDATA)
FAULT_1: FAULT_1.TP R41.1
GND: C1.- C2.1 C3.1 C4.1 C5.1 C6.1 C7.1 C8.1 C9.1 C10.2 C11.1 C14.1 C15.1 C16.1 C17.1 C20.2 C21.1 C22.1 C23.1 C24.1 C25.1 C26.1 C27.1 C28.1 C32.1 C33.1 C34.1 C35.1 C36.1 C37.1 C38.1 C39.1 C40.1 C41.1 C42.1 C43.1 C44.2 C45.2 C46.1 C47.1 C48.1 C49.1 C50.1 C51.1 C52.1 C53.1 C54.1 C55.1 C56.1 C57.1 C58.1 C59.1 C60.1 C61.1 C62.1 C63.1 C64.1 C65.1 C66.1 C67.1 C77.2 C78.2 C79.2 C80.2 C81.2 C82.2 C83.2 C84.2 C85.2 C86.2 C91.2 C92.2 C93.2 C94.2 C95.2 C97.2 C98.2 C99.2 C100.2 C105.2 C106.2 C107.2 C108.2 C112.2 C113.2 C114.2 C115.2 C116.2 C117.2 C118.2 C119.2 C120.1 C121.1 C122.1 C126.1 C127.2 C128.2 C129.1 C130.2 C131.2 C132.2 C133.2 C134.2 C135.2 C136.1 C137.2 C138.2 CR1.1 D2.A IC1.4(GND) IC2.6(CGND) IC2.9(DGND) IC2.22(AGND_1) IC2.25(GNDREF) IC2.65(AGND_2) J1.GND1(GND) J2.2 J2.3 J3.4 JP2.1 LED1.C LED2.C LED9.C@1(C) Q3.2(K) Q3.3(E) R7.2 R8.2 R22.1 R23.1 R26.1 R28.1 R43.1 R44.2 R47.2 R49.1 R51.1 R52.1 R106.2 R110.1 R111.1 R115.2 R116.1 R117.1 TP1.TP U1.1(GND_2) U1.7(WAKE) U1.EPAD(GND) U4.21(GND) U4.41(GND) U4.45(GND) U5.2(GND) U7.2(GND) U7.5(DIR) U8.2(GND) U9.2(GND) U10.2(GND) U12.2(GND) U13.2(GND) U13.5(DIR) U14.2(GND) U16.13(GND) U17.2(GND) U18.13(GND) U19.2(GND)
GND1: U11.2(GND)
ISENSEM: C112.1 R91.2
ISENSEP: C113.1 R92.2
L9963T_2_BNE: R40.1
L9963T_2_DIS: R38.1
L9963T_2_ISO_FREQ: R39.1
L9963T_2_TXEN: R37.1
L9963T_BNE: R35.1
L9963T_DIS: R33.1
L9963T_ISO_FREQ: R34.1
L9963T_TXEN: R36.1
LED1: LED4.A@1(A)
LED2: LED5.A@1(A)
LED_1: U4.20(ADBUS7)
LED_2: U4.29(ACBUS7)
LED_232_RX: R50.1 U4.48(BCBUS3)
LED_232_TX: R53.1 U4.49(BCBUS4)
N$1: U4.19(ADBUS6)
N$2: D1.2(A) J2.1
N$3: U4.24(ACBUS2)
N$4: LED1.A R1.2
N$5: C12.2 JP2.3 JP3.2 JP4.2 R19.1 R20.2 R21.2 U1.9(VS)
N$6: R17.1 R19.2 U1.14(VR1)
N$7: U1.3(RSTN1)
N$8: R16.1 U1.16(VR2)
N$9: C11.2 C17.2 JP1.3 R16.2 R25.2 U1.13(V20)
N$10: U1.2(ADCMON)
N$11: CR1.2 R17.2 U1.8(V10)
N$12: R18.2 U1.5(VDDIO)
N$13: C10.1 R18.1 U1.19(VADC)
N$14: U1.4(RSTN2)
N$15: U1.20(TWN)
N$16: U1.21(WDI)
N$17: U1.22(STBY)
N$18: U1.24(WDO)
N$19: JP3.1 R28.2
N$20: R25.1 R26.2 U1.15(FB2)
N$21: U4.25(ACBUS3)
N$22: U4.26(ACBUS4)
N$23: LED2.A R27.1
N$24: C12.1 U1.10(CP)
N$25: JP2.2 U1.17(CONF1)
N$26: R20.1 R23.2 U1.6(CONF3)
N$27: C14.2 JP4.1 U1.23(WDT)
N$28: R21.1 R22.2 U1.18(CONF2)
N$29: C18.1 U1.12(CP1)
N$30: C18.2 U1.11(CP2)
N$31: U2.1(A:FCCU_F0)
N$32: U2.2(A:PA[0])
N$33: U2.3(A:PA[1])
N$34: U2.4(A:PA[2])
N$35: U2.5(A:PA[3])
N$36: U2.6(A:PA[4])
N$37: U2.7(A:PA[5])
N$38: U2.8(A:PA[6])
N$39: U2.9(A:PA[7])
N$40: U2.10(A:PA[8])
N$41: U2.11(A:PA[9])
N$42: U2.12(A:PA[10])
N$43: U2.13(A:PA[11])
N$44: U2.14(A:PA[12])
N$45: U2.15(A:PA[13])
N$46: U2.16(A:PA[14])
N$47: U2.17(A:PA[15])
N$48: U2.18(A:PB[0])
N$49: U2.19(A:VDD_LV)
N$50: U2.20(A:VDD_HV_IO_MAIN)
N$51: U2.21(A:PB[1])
N$52: U2.22(A:PB[2])
N$53: U2.23(A:PB[3])
N$54: U2.24(A:PB[4])
N$55: U2.25(A:PB[5])
N$56: U2.51(A:VDD_HV_IO)
N$57: U2.50(A:FCCU_F1S)
N$58: U2.49(A:PC[11])
N$59: U2.48(A:PC[10])
N$60: U2.47(A:PC[9])
N$61: U2.46(A:PC[8])
N$62: U2.45(A:PC[7])
N$63: U2.44(A:PC[6])
N$64: U2.43(A:PC[5])
N$65: U2.42(A:PC[4])
N$66: U2.41(A:PI[2])
N$67: U2.40(A:PI[1])
N$68: U2.39(A:VDD_HV_ADC_TSENS)
N$69: U2.38(A:VREFL_ADC)
N$70: U2.37(A:VREFH_ADC)
N$71: U2.36(A:PB[15])
N$72: U2.35(A:PB[14])
N$73: U2.34(A:PB[13])
N$74: U2.33(A:PB[12])
N$75: U2.32(A:PB[11])
N$76: U2.31(A:PB[10])
N$77: U2.30(A:PC[1])
N$78: U2.29(A:PC[0])
N$79: U2.28(A:PB[8])
N$80: U2.27(A:PB[7])
N$81: U2.26(A:PB[6])
N$82: U2.52(B:VDD_LV_2)
N$83: U4.34(BDBUS2)
N$84: R32.1 U2.54(B:XTAL)
N$85: U2.55(B:VDD_HV_OSC)
N$86: U2.56(B:PC[12])
N$87: U2.57(B:PC[13])
N$88: U2.58(B:PC[14])
N$89: U2.59(B:TDI)
N$90: U2.60(B:TMS)
N$91: U2.61(B:TDO)
N$92: U2.62(B:PC[15])
N$93: U2.63(B:TCK)
N$94: U2.64(B:TESTMODE)
N$95: U2.65(B:PD[0])
N$96: U2.66(B:PORST)
N$97: U2.67(B:PD[1])
N$98: U2.68(B:VDD_LV)
N$99: U2.69(B:PD[2])
N$100: U2.70(B:PD[3])
N$101: U2.71(B:PD[4])
N$102: U2.72(B:PD[5])
N$103: U2.73(B:PD[6])
N$104: U2.74(B:PD[7])
N$105: U2.75(B:PD[8])
N$106: U2.76(B:PD[9])
N$107: U2.EPAD(B:VSS_HV_ADR)
N$108: U2.100(B:PE[15])
N$109: U2.99(B:PE[14])
N$110: U2.98(B:PE[13])
N$111: U2.97(B:PE[12])
N$112: U2.96(B:PE[11])
N$113: U2.95(B:VDD_HV_IO_MAIN)
N$114: U2.94(B:PE[10])
N$115: U2.93(B:PE[9])
N$116: U2.92(B:PE[8])
N$117: U2.91(B:PE[7])
N$118: U2.90(B:PE[6])
N$119: U2.89(B:PE[5])
N$120: U2.88(B:PE[4])
N$121: U2.87(B:PE[3])
N$122: U2.86(B:PE[2])
N$123: U2.85(B:VDD_HV_IO_MAIN_2)
N$124: U2.84(B:PE[1])
N$125: U2.83(B:PE[0])
N$126: U2.82(B:PD[15])
N$127: U2.81(B:PD[14])
N$128: U2.80(B:PD[13])
N$129: U2.79(B:PD[12])
N$130: U2.78(B:PD[11])
N$131: U2.77(B:PD[10])
N$132: C13.1 U3.3(!MR)
N$133: C13.2 U3.1(VSS)
N$134: LED3.A R24.1
N$135: U4.35(BDBUS3)
N$136: U4.42(BCBUS0)
N$137: U4.46(BCBUS1)
N$138: U4.47(BCBUS2)
N$139: U4.51(BCBUS5)
N$140: R30.2
N$141: U4.52(BCBUS6)
N$142: C29.1 C30.1 C31.1
N$143: U4.53(BCBUS7)
N$144: U6.2(GND)
N$145: C32.2 Q1.1 R32.2
N$146: C15.2 Q1.2 U2.53(B:EXTAL)
N$147: J1.VBUS1(VBUS) L1.1
N$148: R45.1 U11.6(I/O1)
N$149: R46.1 U11.4(I/O2)
N$150: L2.1 U4.9(VPLL)
N$151: L3.1 U4.5(VPHY)
N$152: C45.1 U4.4(OSCO) Y1.P1
N$153: C44.1 U4.3(OSCI) Y1.P3
N$154: R47.1 U4.6(REF)
N$155: R48.1 U4.11(!RESET#)
N$156: U4.10(TEST)
N$157: U4.54(!PWREN#)
N$158: U4.30(!SUSPEND#)
N$160: LED4.C@1(C) R49.2
N$161: LED5.C@1(C) R51.2
N$162: LED6.C@1(C) R52.2
N$163: LED7.C@1(C) R50.2
N$164: LED8.C@1(C) R53.2
N$165: C68.2 C75.1 FB3.1 R54.2 R55.2 R56.2
N$166: C69.1 C70.2 FB5.1 R58.2 R59.2 R60.2
N$167: C71.1 C72.2 FB7.1 R61.2 R62.2 R63.2
N$168: C73.1 C74.2 FB9.1 R66.2 R67.2 R68.2
N$169: C87.2 C96.1 FB11.1 R73.2 R74.2 R75.2
N$170: C88.1 C89.2 FB13.1 R76.2 R77.2 R78.2
N$171: C90.1 FB15.1 R81.2 R82.2
N$172: C101.1 C102.1 C103.1 C104.1 R87.2 R88.2 R89.2 R90.2
N$173: LED9.A@1(A) R96.1
N$174: IC2.18(VREG)
N$175: C121.2 R97.1 R98.2
N$176: T1.3 U14.6(I/O1)
N$177: T1.4 U14.4(I/O2)
N$178: C122.2 U14.5(VBUS)
N$179: C123.1 R99.2 R102.1 U15.1(I/O1_2)
N$180: C124.2 R100.1 R101.1 U15.3(I/O2_2)
N$181: C125.2 R99.1 R100.2
N$182: C123.2 C124.1 C125.1 U15.2(GND)
N$183: C126.2 U15.5(VBUS)
N$184: U15.6(I/O1)
N$185: U15.4(I/O2)
N$186: Q3.1(A) R103.2
N$187: Q3.4(C) R104.1
N$188: R103.1
N$189: R104.2
N$190: C128.1 R107.2 U16.15(ISOP) U17.1(I/O1_2)
N$191: C131.1 R107.1 R108.2
N$192: C129.2 R108.1 U16.14(ISOM) U17.3(I/O2_2)
N$193: C127.1 U16.16(VDD)
N$194: R105.1 R106.1 U16.12(NSLAVE)
N$195: T2.2 U17.6(I/O1)
N$196: T2.1 U17.4(I/O2)
N$197: C130.1 U17.5(VBUS)
N$198: C132.1 R109.2 U16.1(VIO)
N$199: U16.2(SDO)
N$200: U16.3(SCK)
N$201: U16.4(SDI)
N$202: R109.1 U16.6(DIS)
N$203: R111.2 U16.7(ISOFREQ)
N$204: R110.2 U16.8(BNE/CPOL)
N$205: C133.1 U18.16(VDD)
N$206: C135.1 R112.2 U18.15(ISOP) U19.1(I/O1_2)
N$207: C134.1 R112.1 R113.2
N$208: C136.2 R113.1 U18.14(ISOM) U19.3(I/O2_2)
N$209: C137.1 U19.5(VBUS)
N$210: T3.2 U19.6(I/O1)
N$211: T3.1 U19.4(I/O2)
N$212: R114.1 R115.1 U18.12(NSLAVE)
N$213: R114.2
N$214: C138.1 R118.2 U18.1(VIO)
N$215: U18.2(SDO)
N$216: U18.3(SCK)
N$217: U18.4(SDI)
N$218: R118.1 U18.6(DIS)
N$219: R117.2 U18.7(ISOFREQ)
N$220: R116.2 U18.8(BNE/CPOL)
N$221: R105.2
NTC1+: C101.2 C105.1 R83.1 R87.1
NTC2+: C102.2 C106.1 R84.1 R88.1
NTC3+: C104.2 C107.1 R85.1 R89.1
NTC4+: C103.2 C108.1 R86.1 R90.1
PA11: R40.2
PA14: R41.2
PC4: R35.2
PC5: R34.2
PC7: R33.2
PD3: R11.2
PD4: R12.2
PD5: R13.2
PD6: R14.2
PD7: R15.2
PD8: R37.2
PD9: R36.2
PE1: R38.2
PE2: R39.2
PORST: C19.1 LED3.C R9.2 R10.2 R29.1 TP5.TP U3.2(!RST)
POWER_DEVICE: C1.+ C2.2 C3.2 C4.2 D1.1(K) R1.1 TP2.TP
RSTN1: C6.2 R3.2 R9.1
RSTN2: C7.2 R5.2 R10.1
RTCK_1: U4.18(ADBUS5)
RXD: J3.2 U12.4(B)
SRST#_DIR: R44.1 U4.27(ACBUS5) U10.5(DIR)
SRST#_O: R43.2 U4.23(ACBUS1) U10.3(A)
SRST#_USB: U10.4(B)
STBY: R7.1 R13.1
TCK_O: U4.12(ADBUS0) U5.3(A)
TCK_USB: U5.4(B)
TDI_O: U4.13(ADBUS1) U6.3(A)
TDI_USB: U6.4(B)
TDO_I: U4.14(ADBUS2) U7.3(A)
TDO_USB: U7.4(B)
TMS_DIR: R42.2 U4.28(ACBUS6) U8.5(DIR)
TMS_IO: U4.15(ADBUS3) U4.17(ADBUS4) U8.3(A)
TMS_USB: U8.4(B)
TRST#_O: U4.22(ACBUS0) U9.3(A)
TRST#_USB: U9.4(B)
TWN: C8.2 R4.2 R11.1
TXD: J3.3 U13.4(B)
USB+: R46.2 U4.8(DP)
USB-: R45.2 U4.7(DM)
USB_RX: U4.33(BDBUS1) U13.3(A)
USB_TX: U4.32(BDBUS0) U12.3(A)
USB_VCC: C47.2 C64.2 IC1.1(IN) L1.2 U11.5(VBUS)
USBVCC: JP1.1
V_CORE: C48.2 C49.2 C50.2 C51.2 U4.2(VCORE) U4.31(VCORE) U4.43(VREGOUT)
VBATCELL: C114.1 FB16.2 R93.2
VBATUP: R94.2
VCIO: C65.2 C66.2 C67.2 J3.1 LED6.A@1(A) U5.6(VCCB) U6.6(VCCB) U7.6(VCCB) U8.6(VCCB) U9.6(VCCB) U10.6(VCCB) U12.6(VCCB) U13.6(VCCB)
VDD5: JP1.2 R27.2 R30.1 TP4.TP
VDD_HV_ADC: C24.2 C27.2 C28.2 R31.2
VDD_HV_IO_MAIN: C19.2 C35.2 C36.2 C37.2 C38.2 C39.2 C40.2 C41.2 C42.2 C43.2 R24.2 R29.2 U3.4(!VCC)
VDD_HV_OSC: C33.2 C34.2
VDD_LV: C16.2 C20.1 C21.2 C22.2 C23.2 C25.2 C26.2
VDDIO: R2.1 R3.1 R4.1 R5.1 R6.1 TP3.TP
VPHY: C57.2 C58.2
VPLL: C59.2 C60.2
VREFH_ADC: C29.2 C30.2 C31.2 R31.1
WDI: R8.1 R14.1
WDO: C9.2 R6.2 R15.1
Unconnected: IC2.1(GPIO8__SCK) IC2.2(GPIO9__SDO) IC2.5(VCOM) IC2.10(GPIO1__FAULTH) IC2.11(GPIO2__FAULTL) IC2.16(GPIO7__WAKEUP) IC2.19(VTREF) IC2.20(SPIEN) IC2.21(VANA) IC2.63(CAP2) IC2.64(CAP1) J1.ID1(USBID) J1.SHLD1(SHIELD) J1.SHLD2(SHIELD) J1.SHLD3(SHIELD) T1.1 T1.2 T2.3 T2.4 T3.3 T3.4 U16.5(NCS) U16.9(TXAMP) U16.10(SPICLKFREQ) U16.11(TXEN/CPHA) U18.5(NCS) U18.9(TXAMP) U18.10(SPICLKFREQ) U18.11(TXEN/CPHA)

## Notes on the sheet
- 3
- 1 | 2
- 4 | 5

## Power pins joined to a net without a drawn wire
EXP: U4.57(EXP)

## Library data of the parts
C1 = rcl:CPOL-US: POLARIZED CAPACITOR, American symbol; SPICEPREFIX: C
C2-C138 = rcl:C-EU: CAPACITOR, European symbol; SPICEPREFIX: C
CR1 = stps3l40:STPS3L40SY; COPYRIGHT: Copyright (C) 2022 Ultra Librarian. All rights reserved.; MANUFACTURER_PART_NUMBER: STPS3L40SY; MFR_NAME: STMicroelectronics
D1 = STMicroelectronics - STTH2R02U:STMICROELECTRONICS_STTH2R02U: DIODE GEN PURP 200V 2A SMB; AUTOMOTIVE: No; CENTROID_NOT_SPECIFIED: No; DATASHEET: https://www.st.com/content/ccc/resource/technical/document/datasheet/group2/22/04/b2/71/c0/82/44/72/CD00110332/files/CD00110332.pdf/jcr:content/translations/en.CD00110332.pdf; DEVICE_CLASS_L1: Discrete Semiconductors; DEVICE_CLASS_L2: Diodes; DEVICE_CLASS_L3: Rectifier Diodes; DIGIKEY_DESCRIPTION: DIODE GEN PURP 200V 2A SMB; DIGIKEY_PART_NUMBER: 497-5256-1-ND; FOOTPRINT_VARIANT_NAME_0: Recommended_Land_Pattern; FORWARD_CURRENT: 2A; HEIGHT: 2.65mm; LEAD_FREE: Yes; MAX_JUNCTION_TEMP: +175°C; MAX_REPETITIVE_REVERSE_VOLTAGE: 200V; MAX_SURGE_FORWARD_CURRENT: 75A; MF: STMicroelectronics; MFG_PACKAGE_IDENT: SMB; MFG_PACKAGE_IDENT_DATE: 0; MFG_PACKAGE_IDENT_REV: 0; MOUSER_DESCRIPTION: Rectifiers ULTRAFAST RECOVERY; MOUSER_PART_NUMBER: 511-STTH2R02U; MPN: STTH2R02U; PACKAGE: SMB; PEAK_REVERSE_CURRENT: 3uA; PREFIX: D; ROHS: Yes; STANDOFF_HEIGHT: 0.05mm; TEMPERATURE_RANGE_HIGH: +175°C; VERIFICATION_VERSION: 0.0.0.2
D2 = SparkFun-DiscreteSemi:DIODE-ZENER: Zener Diode A Zener diode allows current to flow from its anode to its cathode like a normal semiconductor diode, but it also permits current to flow in the reverse direction when its "Zener voltage" is reached. - WIkipedia; PROD_ID: DIO-12989
FAULT_1 TP1-TP5 = testpad:TP: Test pad
FB1-FB16 = MPZ2012S102ATD25:MPZ2012S102ATD25: Check prices <https://pricing.snapeda.com/parts/MPZ2012S102ATD25/TDK/view-part?ref=eda>; AVAILABILITY: In Stock; DESCRIPTION: 1 kOhms @ 100 MHz 1 Power Line Ferrite Bead 0805 (2012 Metric) 1.5A 150mOhm; MF: TDK; MP: MPZ2012S102ATD25; PACKAGE: 0805 TDK; PRICE: None; PURCHASE-URL: https://pricing.snapeda.com/search/part/MPZ2012S102ATD25/?ref=eda
IC1 = v-reg:LP2950?*: Source: http://cache.national.com/ds/LP/LP2950.pdf
IC2 = L9963E:L9963E: Battery Management Automotive chip for battery management applications daisy chain up to 31 devices Source: Datasheet <https://www.st.com/resource/en/datasheet/l9963e.pdf>; ARROW_PART_NUMBER: L9963E; ARROW_PRICE-STOCK: https://www.arrow.com/en/products/l9963e/stmicroelectronics?region=nac; DESCRIPTION: Battery Management Automotive chip for battery management applications daisy chain up to 31 devices; HEIGHT: 1.2mm; MANUFACTURER_NAME: STMicroelectronics; MANUFACTURER_PART_NUMBER: L9963E; MOUSER_PART_NUMBER: 511-L9963E; MOUSER_PRICE-STOCK: https://www.mouser.co.uk/ProductDetail/STMicroelectronics/L9963E?qs=CiayqK2gdcLHuPZfXyysMw%3D%3D
J1 = SparkFun-Connectors:USB_AB: USB Type AB Micro Connector OTG-compatible. 5 pins, 3 shield pins SparkFun Products: IOIO-OTG <https://www.sparkfun.com/products/13613> SparkFun SAMD21 Mini Breakout <https://www.sparkfun.com/products/13664>; PROD_ID: CONN-11794
J2 = con-jack:DCJ0202: DC POWER JACK Source: DCJ0202.pdf; OC_FARNELL: unknown; OC_NEWARK: unknown
J3 = Headers:621304284521: 2.00mm SMT Angled Dual Pin Header WR-PHD Manufacturer's datasheet <https://katalog.we-online.com/em/datasheet/621304284521.pdf>; CREATED_BY: PCBLayout.com; MANUFACTURER: Wurth Elektronik; MPN: 621304284521
JP1 JP2 = jumper:JP2E: JUMPER
JP3 JP4 = jumper:JP1E: JUMPER
L1-L3 = rcl:L-US: INDUCTOR, American symbol; SPICEPREFIX: L
LED1-LED3 = led:*P4: PointLED® Enhanced Thinfilm LED TOP & BOTTOM mount LS P47F, LR P47F, LA P47F, LY P47F, LT P4SG, LB P4SG, LW P4SG Source: http://catalog.osram-os.com .. LA_LR_LS_LY_P47F_Pb_free.pdf
LED4-LED9 = adafruit:LED: LED OSRAM: - CHIPLED LG R971, LG N971, LY N971, LG Q971, LY Q971, LO R971, LY R971 LH N974, LH R974 LS Q976, LO Q976, LY Q976 LO Q996 - Hyper CHIPLED LW Q18S LB Q993, LB Q99A, LB R99A - SideLED LS A670, LO A670, LY A670, LG A670, LP A670 LB A673, LV A673, LT A673, LW A673 LH A674 LY A675 LS A676, LA A676, LO A676, LY A676, LW A676 LS A679, LY A679, LG A679 - Hyper Micro SIDELED® LS Y876, LA Y876, LO Y876, LY Y876 LT Y87S - SmartLED LW L88C, LW L88S LB L89C, LB L89S, LG L890 LS L89K, LO L89K, LY L89K LS L896, LA L896, LO L896, LY L896 - TOPLED LS T670, LO T670, LY T670, LG T670, LP T670 LSG T670, LSP T670, LSY T670, LOP T670, LYG T670 LG T671, LOG T671, LSG T671 LB T673, LV T673, LT T673, LW T673 LH T674 LS T676, LA T676, LO T676, LY T676, LB T676, LH T676, LSB T676, LW T676 LB T67C, LV T67C, LT T67C, LS T67K, LO T67K, LY T67K, LW E67C LS E67B, LA E67B, LO E67B, LY E67B, LB E67C, LV E67C, LT E67C LW T67C LS T679, LY T679, LG T679 LS T770, LO T770, LY T770, LG T770, LP T770 LB T773, LV T773, LT T773, LW T773 LH T774 LS E675, LA E675, LY E675, LS T675 LS T776, LA T776, LO T776, LY T776, LB T776 LHGB T686 LT T68C, LB T68C - Hyper Mini TOPLED® LB M676 - Mini TOPLED Santana® LG M470 LS M47K, LO M47K, LY M47K Source: http://www.osram.convergy.de/
Q1 = crystal:CRYSTAL: CRYSTAL; OC_FARNELL: 1666969; OC_NEWARK: unknown
Q2 = adafruit:MOSFET-N: N-Channel Mosfet 2N7002E - 60V 260mA SOT23 [Digikey: 2N7002ET1GOSTR-ND] - REEL BSH103 - 30V 850mA SOT23 [Digikey: 568-5013-1-ND]
Q3 = SamacSys_Parts:TLX9291A_GBTPL,F: Transistor Output Optocouplers Transistor Coupler Automotive; AEC-Q101 Source: Datasheet <https://toshiba.semicon-storage.com/info/docget.jsp?did=53137&prodName=TLX9291A>; DESCRIPTION: Transistor Output Optocouplers Transistor Coupler Automotive; AEC-Q101; HEIGHT: 2.3mm; MANUFACTURER_NAME: Toshiba; MANUFACTURER_PART_NUMBER: TLX9291A(GBTPL,F; MOUSER_PART_NUMBER: 757-TLX9291AGBTPLF; MOUSER_PRICE-STOCK: https://www.mouser.co.uk/ProductDetail/Toshiba/TLX9291AGBTPLF?qs=YwPsRIUVAOcOvZScDNZO1w%3D%3D
R1-R28 R31 R33-R35 R38-R53 = rcl:R-US_: RESISTOR, American symbol; SPICEPREFIX: R
R29 R30 R32 R36 R37 R54-R118 = rcl:R-EU_: RESISTOR, European symbol; SPICEPREFIX: R
T1-T3 = ESMIT-4180_C:ESMIT-4180/C: Audio Transformer, 3750 Vrms Isolation, DC Resistance Primary-Secondary 250 mOhm, SMT Check prices <https://pricing.snapeda.com/parts/ESMIT-4180/C/Sumida%20America/view-part?ref=eda>; AVAILABILITY: In Stock; DESCRIPTION: - Impedance Primary Ohms - Impedance Secondary Ohms - Audio Transformer - Surface Mount; MF: Sumida America; MP: ESMIT-4180/C; PACKAGE: 0805 Sumida; PRICE: None; PURCHASE-URL: https://pricing.snapeda.com/search/part/ESMIT-4180/C/?ref=eda
U1 = L9001:L9001; COPYRIGHT: Copyright (C) 2022 Ultra Librarian. All rights reserved.; DIGI-KEY_PART_NUMBER_1: L9001-ND; MANUFACTURER_PART_NUMBER: L9001; MFR_NAME: STMicroelectronics
U2 = SPC574S64E3:SPC574S64E3CEFAR; COPYRIGHT: Copyright (C) 2022 Ultra Librarian. All rights reserved.; MANUFACTURER_PART_NUMBER: SPC574S64E3CEFAR; MFR_NAME: STMicroelectronics
U3 = STM6315:STM6315SDW13F; COPYRIGHT: Copyright (C) 2022 Ultra Librarian. All rights reserved.; MANUFACTURER_PART_NUMBER: STM6315SDW13F; MFR_NAME: STMicroelectronics
U4 = FT2232H-56Q-REEL:FT2232H-56Q-REEL: Interface Bridge, Usb-Uart/Fifo, Qfn-56 Check availability <https://pricing.snapeda.com/parts/FT2232H-56Q-REEL/FTDI%2C/view-part?ref=eda>; AVAILABILITY: In Stock; DESCRIPTION: USB Bridge, USB to UART,FIFO USB 2.0 UART, FIFO Interface 56-VQFN (8x8); MF: FTDI,; MP: FT2232H-56Q-REEL; PACKAGE: VQFN-56 FTDI; PRICE: None; PURCHASE-URL: https://pricing.snapeda.com/search/part/FT2232H-56Q-REEL/?ref=eda
U5-U10 U12 U13 = SN74LVC1T45DCKT:SN74LVC1T45DCKT: Check availability <https://pricing.snapeda.com/parts/SN74LVC1T45DCKT/Texas%20Instruments/view-part?ref=eda>; AVAILABILITY: In Stock; DESCRIPTION: Single-Bit Dual-Supply Bus Transceiver with Configurable Voltage-Level Shifting and 3-State Outputs; MF: Texas Instruments; MP: SN74LVC1T45DCKT; PACKAGE: SOT-SC70-6 Texas Instruments; PRICE: None; PURCHASE-URL: https://pricing.snapeda.com/search/part/SN74LVC1T45DCKT/?ref=eda
U11 U14 U15 U17 U19 = USBLC6-2SC6Y:USBLC6-2SC6Y; COPYRIGHT: Copyright (C) 2021 Ultra Librarian. All rights reserved.; MANUFACTURER_PART_NUMBER: USBLC6-2SC6Y; MFR_NAME: STMicroelectronics
U16 U18 = L9963:L9963T; COPYRIGHT: Copyright (C) 2021 Ultra Librarian. All rights reserved.; MANUFACTURER_PART_NUMBER: L9963T; MFR_NAME: STMicroelectronics
Y1 = SparkFun-Clocks:CRYSTAL-12MHZ: 12.0MHz Crystal Frequency: 12.0MHz Frequency Tolerance: ±20ppm Load Capacitance: 18pF SparkFun Products: SparkFun Logomatic <https://www.sparkfun.com/products/12772> Pocket AVR Programmer <https://www.sparkfun.com/products/9825>; PROD_ID: XTAL-15540